# Altium project S7CAS-PLEIADES-CARTE-MERE_P02.PrjPCB (part 2 of 3)

## Sheet S7CAS-PLEIADES-CARTE-MERE_P02_FPGA_B2B3.SchDoc
size Tabloid; DocumentNumber: 6; SheetNumber: 6; SheetTotal: 14; Size: 11x17; Sheet_Name: FPGA Bank2-3
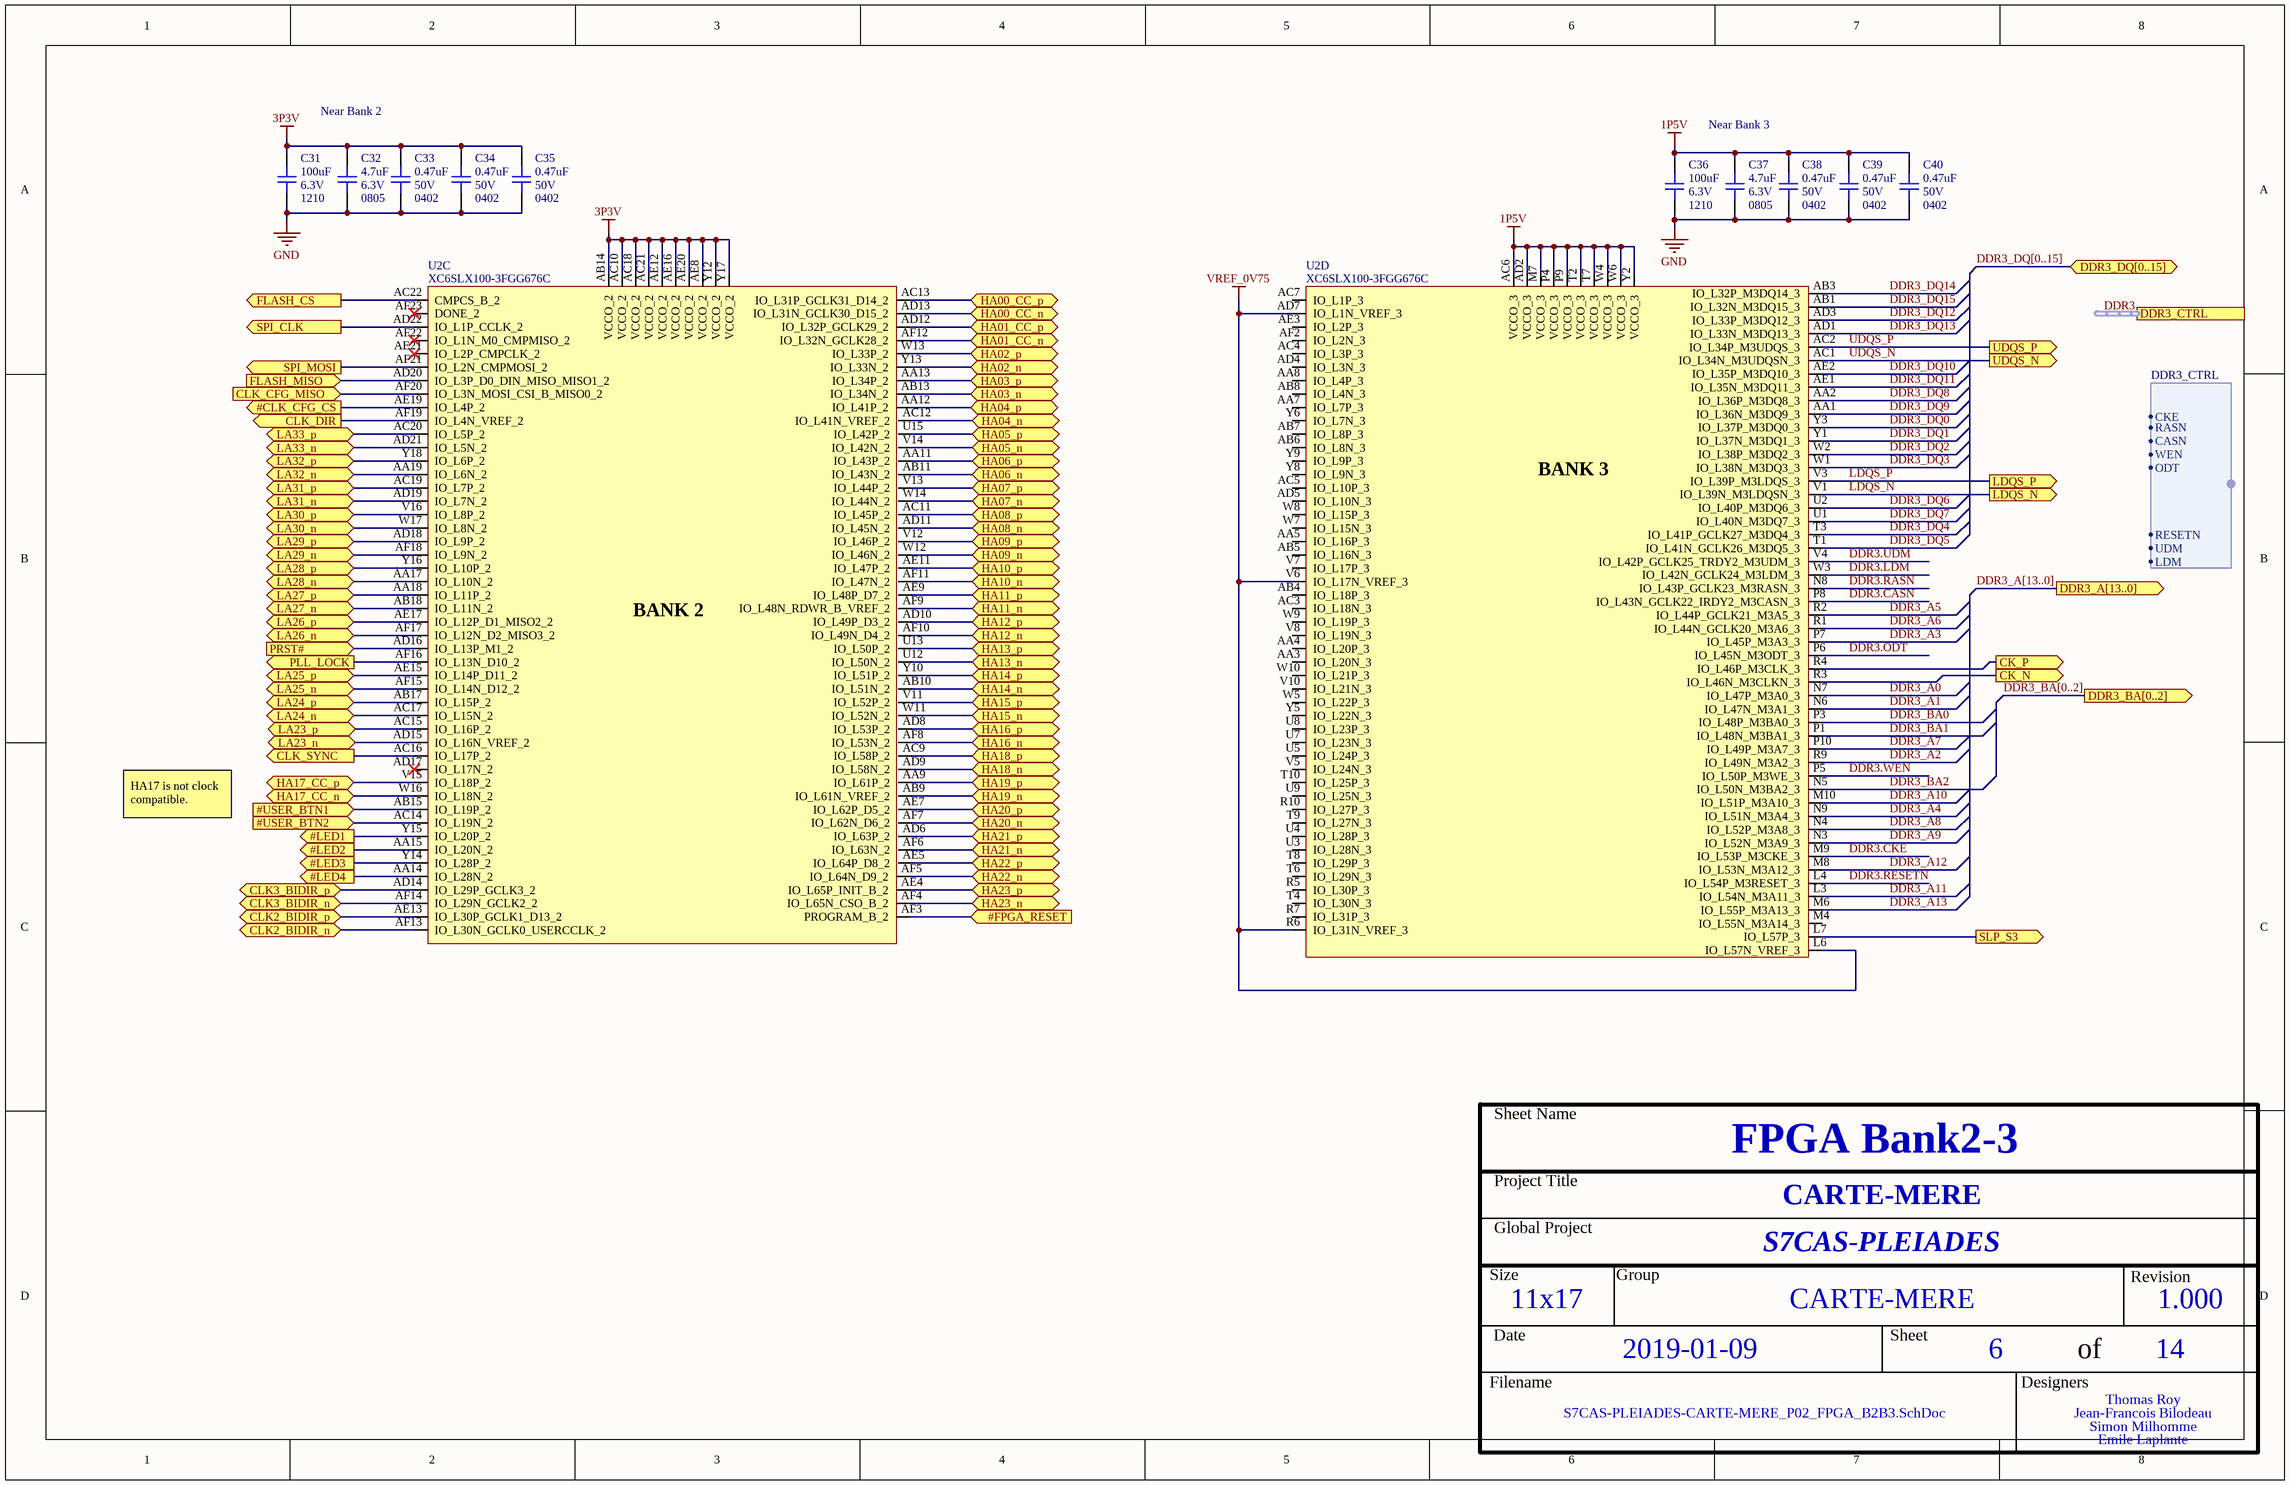
[diagram p4: S7CAS-PLEIADES-CARTE-MERE_P02_FPGA_B2B3.SchDoc]

### Parts
C31  value 100uF  Voltage: 6.3V  Package: 1210  [CAP_1210]  (hidden comment: CAP - 1210)
C32  value 4.7uF  Voltage: 6.3V  Package: 0805  [CAP_0805]  (hidden comment: CAP - 0805)
C33  value 0.47uF  Voltage: 50V  Package: 0402  [CAP_0402]  (hidden comment: CAP - 0402)
C34  value 0.47uF  Voltage: 50V  Package: 0402  [CAP_0402]  (hidden comment: CAP - 0402)
C35  value 0.47uF  Voltage: 50V  Package: 0402  [CAP_0402]  (hidden comment: CAP - 0402)
C36  value 100uF  Voltage: 6.3V  Package: 1210  [CAP_1210]  (hidden comment: CAP - 1210)
C37  value 4.7uF  Voltage: 6.3V  Package: 0805  [CAP_0805]  (hidden comment: CAP - 0805)
C38  value 0.47uF  Voltage: 50V  Package: 0402  [CAP_0402]  (hidden comment: CAP - 0402)
C39  value 0.47uF  Voltage: 50V  Package: 0402  [CAP_0402]  (hidden comment: CAP - 0402)
C40  value 0.47uF  Voltage: 50V  Package: 0402  [CAP_0402]  (hidden comment: CAP - 0402)
U2  XC6SLX100-3FGG676C  [FPGA_XILINX_FGG676]  (parts C,D of 10)

### Ports
#CLK_CFG_CS (out), #FPGA_RESET (in), #LED1 (out), #LED2 (out), #LED3 (out), #LED4 (out), #USER_BTN1 (in), #USER_BTN2 (in), CK_N (out), CK_P (out), CLK2_BIDIR_n (bidir), CLK2_BIDIR_p (bidir), CLK3_BIDIR_n (bidir), CLK3_BIDIR_p (bidir), CLK_CFG_MISO (in), CLK_DIR (out), CLK_SYNC (out), DDR3_A[13..0] (out), DDR3_BA[0..2] (out), DDR3_CTRL (harness DDR_CTRL), DDR3_DQ[0..15] (bidir), FLASH_CS (out), FLASH_MISO (in), HA00_CC_n (bidir), HA00_CC_p (bidir), HA01_CC_n (bidir), HA01_CC_p (bidir), HA02_n (bidir), HA02_p (bidir), HA03_n (bidir), HA03_p (bidir), HA04_n (bidir), HA04_p (bidir), HA05_n (bidir), HA05_p (bidir), HA06_n (bidir), HA06_p (bidir), HA07_n (bidir), HA07_p (bidir), HA08_n (bidir), HA08_p (bidir), HA09_n (bidir), HA09_p (bidir), HA10_n (bidir), HA10_p (bidir), HA11_n (bidir), HA11_p (bidir), HA12_n (bidir), HA12_p (bidir), HA13_n (bidir), HA13_p (bidir), HA14_n (bidir), HA14_p (bidir), HA15_n (bidir), HA15_p (bidir), HA16_n (bidir), HA16_p (bidir), HA17_CC_n (bidir), HA17_CC_p (bidir), HA18_n (bidir), HA18_p (bidir), HA19_n (bidir), HA19_p (bidir), HA20_n (bidir), HA20_p (bidir), HA21_n (bidir), HA21_p (bidir), HA22_n (bidir), HA22_p (bidir), HA23_n (bidir), HA23_p (bidir), LA23_n (bidir), LA23_p (bidir), LA24_n (bidir), LA24_p (bidir), LA25_n (bidir), LA25_p (bidir), LA26_n (bidir), LA26_p (bidir), LA27_n (bidir), LA27_p (bidir), LA28_n (bidir), LA28_p (bidir), LA29_n (bidir), LA29_p (bidir), LA30_n (bidir), LA30_p (bidir), LA31_n (bidir), LA31_p (bidir), LA32_n (bidir), LA32_p (bidir), LA33_n (bidir), LA33_p (bidir), LDQS_N (out), LDQS_P (out), PLL_LOCK (out), PRST# (in), SLP_S3 (out), SPI_CLK (out), SPI_MOSI (out), UDQS_N (out), UDQS_P (out)

### Harnesses
DDR3_CTRL: CKE, RASN, CASN, WEN, ODT, RESETN, UDM, LDM

### Nets
1P5V: C36.2 C37.2 C38.2 C39.2 C40.2 U2.AC6(VCCO_3) U2.AD2(VCCO_3) U2.M7(VCCO_3) U2.P4(VCCO_3) U2.P9(VCCO_3) U2.T2(VCCO_3) U2.T7(VCCO_3) U2.W4(VCCO_3) U2.W6(VCCO_3) U2.Y2(VCCO_3)
3P3V: C31.2 C32.2 C33.2 C34.2 C35.2 U2.AB14(VCCO_2) U2.AC10(VCCO_2) U2.AC18(VCCO_2) U2.AC21(VCCO_2) U2.AE8(VCCO_2) U2.AE12(VCCO_2) U2.AE16(VCCO_2) U2.AE20(VCCO_2) U2.Y12(VCCO_2) U2.Y17(VCCO_2)
GND: C31.1 C32.1 C33.1 C34.1 C35.1 C36.1 C37.1 C38.1 C39.1 C40.1
VREF_0V75: U2.AD7(IO_L1N_VREF_3) U2.L6(IO_L57N_VREF_3) U2.R6(IO_L31N_VREF_3) U2.V6(IO_L17N_VREF_3)
#CLK_CFG_CS: U2.AE19(IO_L4P_2) ; port #CLK_CFG_CS
#FPGA_RESET: U2.AF3(PROGRAM_B_2) ; port #FPGA_RESET
#LED1: U2.Y15(IO_L20P_2) ; port #LED1
#LED2: U2.AA15(IO_L20N_2) ; port #LED2
#LED3: U2.Y14(IO_L28P_2) ; port #LED3
#LED4: U2.AA14(IO_L28N_2) ; port #LED4
#USER_BTN1: U2.AB15(IO_L19P_2) ; port #USER_BTN1
#USER_BTN2: U2.AC14(IO_L19N_2) ; port #USER_BTN2
CK_N: U2.R3(IO_L46N_M3CLKN_3) ; port CK_N
CK_P: U2.R4(IO_L46P_M3CLK_3) ; port CK_P
CLK2_BIDIR_n: U2.AF13(IO_L30N_GCLK0_USERCCLK_2) ; port CLK2_BIDIR_n
CLK2_BIDIR_p: U2.AE13(IO_L30P_GCLK1_D13_2) ; port CLK2_BIDIR_p
CLK3_BIDIR_n: U2.AF14(IO_L29N_GCLK2_2) ; port CLK3_BIDIR_n
CLK3_BIDIR_p: U2.AD14(IO_L29P_GCLK3_2) ; port CLK3_BIDIR_p
CLK_CFG_MISO: U2.AF20(IO_L3N_MOSI_CSI_B_MISO0_2) ; port CLK_CFG_MISO
CLK_DIR: U2.AF19(IO_L4N_VREF_2) ; port CLK_DIR
CLK_SYNC: U2.AC16(IO_L17P_2) ; port CLK_SYNC
DDR3.CASN: U2.P8(IO_L43N_GCLK22_IRDY2_M3CASN_3)
DDR3.CKE: U2.M9(IO_L53P_M3CKE_3)
DDR3.LDM: U2.W3(IO_L42N_GCLK24_M3LDM_3)
DDR3.ODT: U2.P6(IO_L45N_M3ODT_3)
DDR3.RASN: U2.N8(IO_L43P_GCLK23_M3RASN_3)
DDR3.RESETN: U2.L4(IO_L54P_M3RESET_3)
DDR3.UDM: U2.V4(IO_L42P_GCLK25_TRDY2_M3UDM_3)
DDR3.WEN: U2.P5(IO_L50P_M3WE_3)
DDR3_A0: U2.N7(IO_L47P_M3A0_3)
DDR3_A1: U2.N6(IO_L47N_M3A1_3)
DDR3_A2: U2.R9(IO_L49N_M3A2_3)
DDR3_A3: U2.P7(IO_L45P_M3A3_3)
DDR3_A4: U2.N9(IO_L51N_M3A4_3)
DDR3_A5: U2.R2(IO_L44P_GCLK21_M3A5_3)
DDR3_A6: U2.R1(IO_L44N_GCLK20_M3A6_3)
DDR3_A7: U2.P10(IO_L49P_M3A7_3)
DDR3_A8: U2.N4(IO_L52P_M3A8_3)
DDR3_A9: U2.N3(IO_L52N_M3A9_3)
DDR3_A10: U2.M10(IO_L51P_M3A10_3)
DDR3_A11: U2.L3(IO_L54N_M3A11_3)
DDR3_A12: U2.M8(IO_L53N_M3A12_3)
DDR3_A13: U2.M6(IO_L55P_M3A13_3)
DDR3_BA0: U2.P3(IO_L48P_M3BA0_3)
DDR3_BA1: U2.P1(IO_L48N_M3BA1_3)
DDR3_BA2: U2.N5(IO_L50N_M3BA2_3)
DDR3_DQ0: U2.Y3(IO_L37P_M3DQ0_3)
DDR3_DQ1: U2.Y1(IO_L37N_M3DQ1_3)
DDR3_DQ2: U2.W2(IO_L38P_M3DQ2_3)
DDR3_DQ3: U2.W1(IO_L38N_M3DQ3_3)
DDR3_DQ4: U2.T3(IO_L41P_GCLK27_M3DQ4_3)
DDR3_DQ5: U2.T1(IO_L41N_GCLK26_M3DQ5_3)
DDR3_DQ6: U2.U2(IO_L40P_M3DQ6_3)
DDR3_DQ7: U2.U1(IO_L40N_M3DQ7_3)
DDR3_DQ8: U2.AA2(IO_L36P_M3DQ8_3)
DDR3_DQ9: U2.AA1(IO_L36N_M3DQ9_3)
DDR3_DQ10: U2.AE2(IO_L35P_M3DQ10_3)
DDR3_DQ11: U2.AE1(IO_L35N_M3DQ11_3)
DDR3_DQ12: U2.AD3(IO_L33P_M3DQ12_3)
DDR3_DQ13: U2.AD1(IO_L33N_M3DQ13_3)
DDR3_DQ14: U2.AB3(IO_L32P_M3DQ14_3)
DDR3_DQ15: U2.AB1(IO_L32N_M3DQ15_3)
FLASH_CS: U2.AC22(CMPCS_B_2) ; port FLASH_CS
FLASH_MISO: U2.AD20(IO_L3P_D0_DIN_MISO_MISO1_2) ; port FLASH_MISO
HA00_CC_n: U2.AD13(IO_L31N_GCLK30_D15_2) ; port HA00_CC_n
HA00_CC_p: U2.AC13(IO_L31P_GCLK31_D14_2) ; port HA00_CC_p
HA01_CC_n: U2.AF12(IO_L32N_GCLK28_2) ; port HA01_CC_n
HA01_CC_p: U2.AD12(IO_L32P_GCLK29_2) ; port HA01_CC_p
HA02_n: U2.Y13(IO_L33N_2) ; port HA02_n
HA02_p: U2.W13(IO_L33P_2) ; port HA02_p
HA03_n: U2.AB13(IO_L34N_2) ; port HA03_n
HA03_p: U2.AA13(IO_L34P_2) ; port HA03_p
HA04_n: U2.AC12(IO_L41N_VREF_2) ; port HA04_n
HA04_p: U2.AA12(IO_L41P_2) ; port HA04_p
HA05_n: U2.V14(IO_L42N_2) ; port HA05_n
HA05_p: U2.U15(IO_L42P_2) ; port HA05_p
HA06_n: U2.AB11(IO_L43N_2) ; port HA06_n
HA06_p: U2.AA11(IO_L43P_2) ; port HA06_p
HA07_n: U2.W14(IO_L44N_2) ; port HA07_n
HA07_p: U2.V13(IO_L44P_2) ; port HA07_p
HA08_n: U2.AD11(IO_L45N_2) ; port HA08_n
HA08_p: U2.AC11(IO_L45P_2) ; port HA08_p
HA09_n: U2.W12(IO_L46N_2) ; port HA09_n
HA09_p: U2.V12(IO_L46P_2) ; port HA09_p
HA10_n: U2.AF11(IO_L47N_2) ; port HA10_n
HA10_p: U2.AE11(IO_L47P_2) ; port HA10_p
HA11_n: U2.AF9(IO_L48N_RDWR_B_VREF_2) ; port HA11_n
HA11_p: U2.AE9(IO_L48P_D7_2) ; port HA11_p
HA12_n: U2.AF10(IO_L49N_D4_2) ; port HA12_n
HA12_p: U2.AD10(IO_L49P_D3_2) ; port HA12_p
HA13_n: U2.U12(IO_L50N_2) ; port HA13_n
HA13_p: U2.U13(IO_L50P_2) ; port HA13_p
HA14_n: U2.AB10(IO_L51N_2) ; port HA14_n
HA14_p: U2.Y10(IO_L51P_2) ; port HA14_p
HA15_n: U2.W11(IO_L52N_2) ; port HA15_n
HA15_p: U2.V11(IO_L52P_2) ; port HA15_p
HA16_n: U2.AF8(IO_L53N_2) ; port HA16_n
HA16_p: U2.AD8(IO_L53P_2) ; port HA16_p
HA17_CC_n: U2.W16(IO_L18N_2) ; port HA17_CC_n
HA17_CC_p: U2.V15(IO_L18P_2) ; port HA17_CC_p
HA18_n: U2.AD9(IO_L58N_2) ; port HA18_n
HA18_p: U2.AC9(IO_L58P_2) ; port HA18_p
HA19_n: U2.AB9(IO_L61N_VREF_2) ; port HA19_n
HA19_p: U2.AA9(IO_L61P_2) ; port HA19_p
HA20_n: U2.AF7(IO_L62N_D6_2) ; port HA20_n
HA20_p: U2.AE7(IO_L62P_D5_2) ; port HA20_p
HA21_n: U2.AF6(IO_L63N_2) ; port HA21_n
HA21_p: U2.AD6(IO_L63P_2) ; port HA21_p
HA22_n: U2.AF5(IO_L64N_D9_2) ; port HA22_n
HA22_p: U2.AE5(IO_L64P_D8_2) ; port HA22_p
HA23_n: U2.AF4(IO_L65N_CSO_B_2) ; port HA23_n
HA23_p: U2.AE4(IO_L65P_INIT_B_2) ; port HA23_p
LA23_n: U2.AD15(IO_L16N_VREF_2) ; port LA23_n
LA23_p: U2.AC15(IO_L16P_2) ; port LA23_p
LA24_n: U2.AC17(IO_L15N_2) ; port LA24_n
LA24_p: U2.AB17(IO_L15P_2) ; port LA24_p
LA25_n: U2.AF15(IO_L14N_D12_2) ; port LA25_n
LA25_p: U2.AE15(IO_L14P_D11_2) ; port LA25_p
LA26_n: U2.AF17(IO_L12N_D2_MISO3_2) ; port LA26_n
LA26_p: U2.AE17(IO_L12P_D1_MISO2_2) ; port LA26_p
LA27_n: U2.AB18(IO_L11N_2) ; port LA27_n
LA27_p: U2.AA18(IO_L11P_2) ; port LA27_p
LA28_n: U2.AA17(IO_L10N_2) ; port LA28_n
LA28_p: U2.Y16(IO_L10P_2) ; port LA28_p
LA29_n: U2.AF18(IO_L9N_2) ; port LA29_n
LA29_p: U2.AD18(IO_L9P_2) ; port LA29_p
LA30_n: U2.W17(IO_L8N_2) ; port LA30_n
LA30_p: U2.V16(IO_L8P_2) ; port LA30_p
LA31_n: U2.AD19(IO_L7N_2) ; port LA31_n
LA31_p: U2.AC19(IO_L7P_2) ; port LA31_p
LA32_n: U2.AA19(IO_L6N_2) ; port LA32_n
LA32_p: U2.Y18(IO_L6P_2) ; port LA32_p
LA33_n: U2.AD21(IO_L5N_2) ; port LA33_n
LA33_p: U2.AC20(IO_L5P_2) ; port LA33_p
LDQS_N: U2.V1(IO_L39N_M3LDQSN_3) ; port LDQS_N
LDQS_P: U2.V3(IO_L39P_M3LDQS_3) ; port LDQS_P
PLL_LOCK: U2.AF16(IO_L13N_D10_2) ; port PLL_LOCK
PRST#: U2.AD16(IO_L13P_M1_2) ; port PRST#
SLP_S3: U2.L7(IO_L57P_3) ; port SLP_S3
SPI_CLK: U2.AD22(IO_L1P_CCLK_2) ; port SPI_CLK
SPI_MOSI: U2.AF21(IO_L2N_CMPMOSI_2) ; port SPI_MOSI
UDQS_N: U2.AC1(IO_L34N_M3UDQSN_3) ; port UDQS_N
UDQS_P: U2.AC2(IO_L34P_M3UDQS_3) ; port UDQS_P

Not connected (* = marked no-connect by the designer): U2 AA3(IO_L20N_3) AA4(IO_L20P_3) AA5(IO_L16P_3) AA7(IO_L7P_3) AA8(IO_L4P_3) AB4(IO_L18P_3) AB5(IO_L16N_3) AB6(IO_L8N_3) AB7(IO_L8P_3) AB8(IO_L4N_3) AC3(IO_L18N_3) AC4(IO_L3P_3) AC5(IO_L10P_3) AC7(IO_L1P_3) AD4(IO_L3N_3) AD5(IO_L10N_3) AD17(IO_L17N_2)* AE3(IO_L2P_3) AE21(IO_L2P_CMPCLK_2)* AF2(IO_L2N_3) AF22(IO_L1N_M0_CMPMISO_2)* AF23(DONE_2)* M4(IO_L55N_M3A14_3) R5(IO_L30P_3) R7(IO_L31P_3) R10(IO_L27P_3) T4(IO_L30N_3) T6(IO_L29N_3) T8(IO_L29P_3) T9(IO_L27N_3) T10(IO_L25P_3) U3(IO_L28N_3) U4(IO_L28P_3) U5(IO_L24P_3) U7(IO_L23N_3) U8(IO_L23P_3) U9(IO_L25N_3) V5(IO_L24N_3) V7(IO_L17P_3) V8(IO_L19N_3) V10(IO_L21N_3) W5(IO_L22P_3) W7(IO_L15N_3) W8(IO_L15P_3) W9(IO_L19P_3) W10(IO_L21P_3) Y5(IO_L22N_3) Y6(IO_L7N_3) Y8(IO_L9N_3) Y9(IO_L9P_3)

### Buses and harness runs
bus DDR3_A[13..0] = port DDR3_A[13..0]
bus DDR3_BA[0..2] = port DDR3_BA[0..2]
bus DDR3_DQ[0..15] = port DDR3_DQ[0..15]
harness DDR3 = port DDR3_CTRL

### Notes on the sheet
- Near Bank 2
- Near Bank 3
- HA17 is not clock compatible.
- Sheet Name
- Project Title
- Global Project
- Size
- Group
- Revision
- Date
- Sheet
- of
- Filename
- Designers
- (in symbol FPGA_XC6SLX100-3FGG676C, part C) BANK 2
- (in symbol FPGA_XC6SLX100-3FGG676C, part D) BANK 3

### Library data of the parts
C31 C36 = CAP - 1210: Precision: 10%; Current: *; CreatedBy: Jonathan Bouchard; Power: *
C32 C37 = CAP - 0805: Precision: 10%; Current: *; CreatedBy: Jonathan Bouchard; Power: *
C33-C35 C38-C40 = CAP - 0402: Precision: 10%; Current: *; CreatedBy: Jonathan Bouchard; Power: *
U2 = FPGA_XC6SLX100-3FGG676C: FPGA - XILINX SPARTAN 6 480 I/O - BGA-676; Voltage: 1.14 V ~ 1.26 V; Current: *; Power: *; Mfg: Xilinx; Mfg Part Number: XC6SLX100-3FGG676C; HelpURL: https://www.xilinx.com/support/documentation/data_sheets/ds162.pdf; CreatedBy: Jonathan Bouchard; Temperature: 0°C ~ 85°C (TJ); Value: *; Precision: *; Package: BGA-676; Supplier 1: Digikey; Supplier Part Number 1: 122-1760-ND

## Sheet S7CAS-PLEIADES-CARTE-MERE_P02_FPGA_B4B5.SchDoc
size Tabloid; DocumentNumber: 7; SheetNumber: 7; SheetTotal: 14; Size: 11x17; Sheet_Name: FPGA Bank4-5
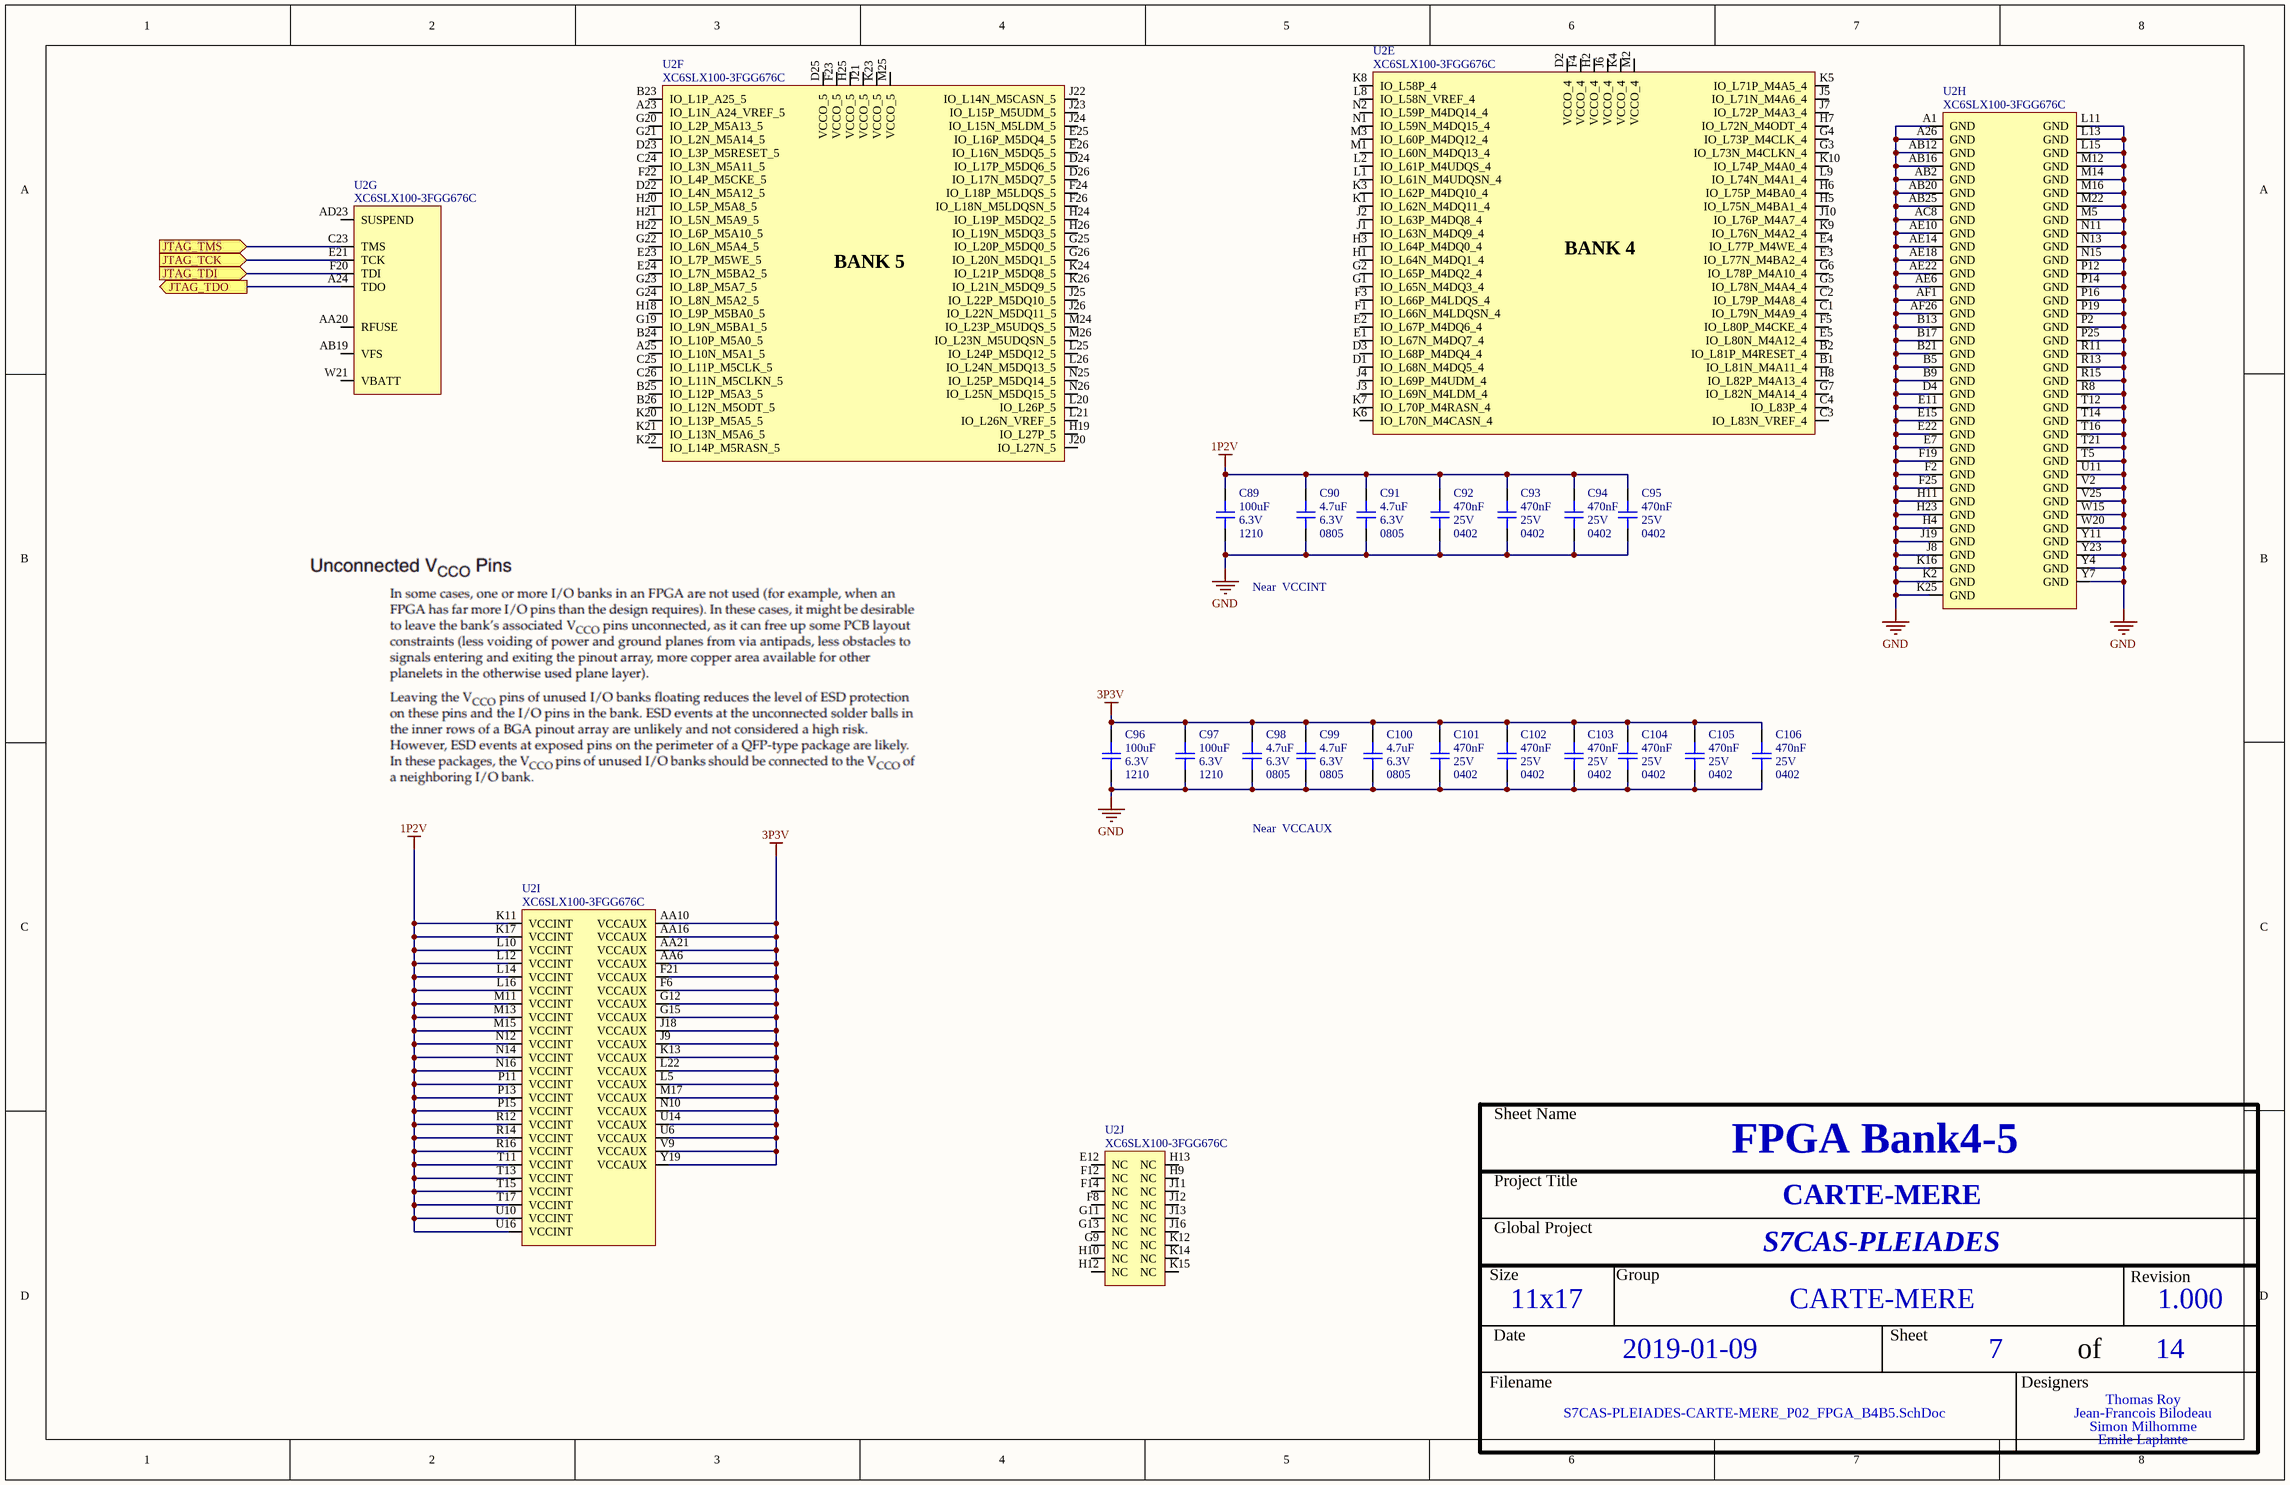
[diagram p5: S7CAS-PLEIADES-CARTE-MERE_P02_FPGA_B4B5.SchDoc]

### Parts
C89  value 100uF  Voltage: 6.3V  Package: 1210  [CAP_1210]  (hidden comment: CAP - 1210)
C90  value 4.7uF  Voltage: 6.3V  Package: 0805  [CAP_0805]  (hidden comment: CAP - 0805)
C91  value 4.7uF  Voltage: 6.3V  Package: 0805  [CAP_0805]  (hidden comment: CAP - 0805)
C92  value 470nF  Voltage: 25V  Package: 0402  [CAP_0402]  (hidden comment: CAP - 0402)
C93  value 470nF  Voltage: 25V  Package: 0402  [CAP_0402]  (hidden comment: CAP - 0402)
C94  value 470nF  Voltage: 25V  Package: 0402  [CAP_0402]  (hidden comment: CAP - 0402)
C95  value 470nF  Voltage: 25V  Package: 0402  [CAP_0402]  (hidden comment: CAP - 0402)
C96  value 100uF  Voltage: 6.3V  Package: 1210  [CAP_1210]  (hidden comment: CAP - 1210)
C97  value 100uF  Voltage: 6.3V  Package: 1210  [CAP_1210]  (hidden comment: CAP - 1210)
C98  value 4.7uF  Voltage: 6.3V  Package: 0805  [CAP_0805]  (hidden comment: CAP - 0805)
C99  value 4.7uF  Voltage: 6.3V  Package: 0805  [CAP_0805]  (hidden comment: CAP - 0805)
C100  value 4.7uF  Voltage: 6.3V  Package: 0805  [CAP_0805]  (hidden comment: CAP - 0805)
C101  value 470nF  Voltage: 25V  Package: 0402  [CAP_0402]  (hidden comment: CAP - 0402)
C102  value 470nF  Voltage: 25V  Package: 0402  [CAP_0402]  (hidden comment: CAP - 0402)
C103  value 470nF  Voltage: 25V  Package: 0402  [CAP_0402]  (hidden comment: CAP - 0402)
C104  value 470nF  Voltage: 25V  Package: 0402  [CAP_0402]  (hidden comment: CAP - 0402)
C105  value 470nF  Voltage: 25V  Package: 0402  [CAP_0402]  (hidden comment: CAP - 0402)
C106  value 470nF  Voltage: 25V  Package: 0402  [CAP_0402]  (hidden comment: CAP - 0402)
U2  XC6SLX100-3FGG676C  [FPGA_XILINX_FGG676]  (parts E,F,G,H,I,J of 10)

### Ports
JTAG_TCK (in), JTAG_TDI (in), JTAG_TDO (out), JTAG_TMS (in)

### Nets
1P2V: C89.2 C90.2 C91.2 C92.2 C93.2 C94.2 C95.2 U2.K11(VCCINT) U2.K17(VCCINT) U2.L10(VCCINT) U2.L12(VCCINT) U2.L14(VCCINT) U2.L16(VCCINT) U2.M11(VCCINT) U2.M13(VCCINT) U2.M15(VCCINT) U2.N12(VCCINT) U2.N14(VCCINT) U2.N16(VCCINT) U2.P11(VCCINT) U2.P13(VCCINT) U2.P15(VCCINT) U2.R12(VCCINT) U2.R14(VCCINT) U2.R16(VCCINT) U2.T11(VCCINT) U2.T13(VCCINT) U2.T15(VCCINT) U2.T17(VCCINT) U2.U10(VCCINT) U2.U16(VCCINT)
3P3V: C96.2 C97.2 C98.2 C99.2 C100.2 C101.2 C102.2 C103.2 C104.2 C105.2 C106.2 U2.AA6(VCCAUX) U2.AA10(VCCAUX) U2.AA16(VCCAUX) U2.AA21(VCCAUX) U2.F6(VCCAUX) U2.F21(VCCAUX) U2.G12(VCCAUX) U2.G15(VCCAUX) U2.J9(VCCAUX) U2.J18(VCCAUX) U2.K13(VCCAUX) U2.L5(VCCAUX) U2.L22(VCCAUX) U2.M17(VCCAUX) U2.N10(VCCAUX) U2.U6(VCCAUX) U2.U14(VCCAUX) U2.V9(VCCAUX) U2.Y19(VCCAUX)
GND: C89.1 C90.1 C91.1 C92.1 C93.1 C94.1 C95.1 C96.1 C97.1 C98.1 C99.1 C100.1 C101.1 C102.1 C103.1 C104.1 C105.1 C106.1 U2.A1(GND) U2.A26(GND) U2.AB2(GND) U2.AB12(GND) U2.AB16(GND) U2.AB20(GND) U2.AB25(GND) U2.AC8(GND) U2.AE6(GND) U2.AE10(GND) U2.AE14(GND) U2.AE18(GND) U2.AE22(GND) U2.AF1(GND) U2.AF26(GND) U2.B5(GND) U2.B9(GND) U2.B13(GND) U2.B17(GND) U2.B21(GND) U2.D4(GND) U2.E7(GND) U2.E11(GND) U2.E15(GND) U2.E22(GND) U2.F2(GND) U2.F19(GND) U2.F25(GND) U2.H4(GND) U2.H11(GND) U2.H23(GND) U2.J8(GND) U2.J19(GND) U2.K2(GND) U2.K16(GND) U2.K25(GND) U2.L11(GND) U2.L13(GND) U2.L15(GND) U2.M5(GND) U2.M12(GND) U2.M14(GND) U2.M16(GND) U2.M22(GND) U2.N11(GND) U2.N13(GND) U2.N15(GND) U2.P2(GND) U2.P12(GND) U2.P14(GND) U2.P16(GND) U2.P19(GND) U2.P25(GND) U2.R8(GND) U2.R11(GND) U2.R13(GND) U2.R15(GND) U2.T5(GND) U2.T12(GND) U2.T14(GND) U2.T16(GND) U2.T21(GND) U2.U11(GND) U2.V2(GND) U2.V25(GND) U2.W15(GND) U2.W20(GND) U2.Y4(GND) U2.Y7(GND) U2.Y11(GND) U2.Y23(GND)
JTAG_TCK: U2.E21(TCK) ; port JTAG_TCK
JTAG_TDI: U2.F20(TDI) ; port JTAG_TDI
JTAG_TDO: U2.A24(TDO) ; port JTAG_TDO
JTAG_TMS: U2.C23(TMS) ; port JTAG_TMS

Not connected (* = marked no-connect by the designer): U2 A23(IO_L1N_A24_VREF_5) A25(IO_L10N_M5A1_5) AA20(RFUSE) AB19(VFS) AD23(SUSPEND) B1(IO_L81N_M4A11_4) B2(IO_L81P_M4RESET_4) B23(IO_L1P_A25_5) B24(IO_L10P_M5A0_5) B25(IO_L12P_M5A3_5) B26(IO_L12N_M5ODT_5) C1(IO_L79N_M4A9_4) C2(IO_L79P_M4A8_4) C3(IO_L83N_VREF_4) C4(IO_L83P_4) C24(IO_L3N_M5A11_5) C25(IO_L11P_M5CLK_5) C26(IO_L11N_M5CLKN_5) D1(IO_L68N_M4DQ5_4) D2(VCCO_4) D3(IO_L68P_M4DQ4_4) D22(IO_L4N_M5A12_5) D23(IO_L3P_M5RESET_5) D24(IO_L17P_M5DQ6_5) D25(VCCO_5) D26(IO_L17N_M5DQ7_5) E1(IO_L67N_M4DQ7_4) E2(IO_L67P_M4DQ6_4) E3(IO_L77N_M4BA2_4) E4(IO_L77P_M4WE_4) E5(IO_L80N_M4A12_4) E12(NC) E23(IO_L7P_M5WE_5) E24(IO_L7N_M5BA2_5) E25(IO_L16P_M5DQ4_5) E26(IO_L16N_M5DQ5_5) F1(IO_L66N_M4LDQSN_4) F3(IO_L66P_M4LDQS_4) F4(VCCO_4) F5(IO_L80P_M4CKE_4) F8(NC) F12(NC) F14(NC) F22(IO_L4P_M5CKE_5) F23(VCCO_5) F24(IO_L18P_M5LDQS_5) F26(IO_L18N_M5LDQSN_5) G1(IO_L65N_M4DQ3_4) G2(IO_L65P_M4DQ2_4) G3(IO_L73N_M4CLKN_4) G4(IO_L73P_M4CLK_4) G5(IO_L78N_M4A4_4) G6(IO_L78P_M4A10_4) G7(IO_L82N_M4A14_4) G9(NC) G11(NC) G13(NC) G19(IO_L9N_M5BA1_5) G20(IO_L2P_M5A13_5) G21(IO_L2N_M5A14_5) G22(IO_L6N_M5A4_5) G23(IO_L8P_M5A7_5) G24(IO_L8N_M5A2_5) G25(IO_L20P_M5DQ0_5) G26(IO_L20N_M5DQ1_5) H1(IO_L64N_M4DQ1_4) H2(VCCO_4) H3(IO_L64P_M4DQ0_4) H5(IO_L75N_M4BA1_4) H6(IO_L75P_M4BA0_4) H7(IO_L72N_M4ODT_4) H8(IO_L82P_M4A13_4) H9(NC) H10(NC) H12(NC) H13(NC) H18(IO_L9P_M5BA0_5) H19(IO_L27P_5) H20(IO_L5P_M5A8_5) H21(IO_L5N_M5A9_5) H22(IO_L6P_M5A10_5) H24(IO_L19P_M5DQ2_5) H25(VCCO_5) H26(IO_L19N_M5DQ3_5) J1(IO_L63N_M4DQ9_4) J2(IO_L63P_M4DQ8_4) J3(IO_L69N_M4LDM_4) J4(IO_L69P_M4UDM_4) J5(IO_L71N_M4A6_4) J6(VCCO_4) J7(IO_L72P_M4A3_4) J10(IO_L76P_M4A7_4) J11(NC) J12(NC) J13(NC) J16(NC) J20(IO_L27N_5) J21(VCCO_5) J22(IO_L14N_M5CASN_5) J23(IO_L15P_M5UDM_5) J24(IO_L15N_M5LDM_5) J25(IO_L22P_M5DQ10_5) J26(IO_L22N_M5DQ11_5) K1(IO_L62N_M4DQ11_4) K3(IO_L62P_M4DQ10_4) K4(VCCO_4) K5(IO_L71P_M4A5_4) K6(IO_L70N_M4CASN_4) K7(IO_L70P_M4RASN_4) K8(IO_L58P_4) K9(IO_L76N_M4A2_4) K10(IO_L74P_M4A0_4) K12(NC) K14(NC) K15(NC) K20(IO_L13P_M5A5_5) K21(IO_L13N_M5A6_5) K22(IO_L14P_M5RASN_5) K23(VCCO_5) K24(IO_L21P_M5DQ8_5) K26(IO_L21N_M5DQ9_5) L1(IO_L61N_M4UDQSN_4) L2(IO_L61P_M4UDQS_4) L8(IO_L58N_VREF_4) L9(IO_L74N_M4A1_4) L20(IO_L26P_5) L21(IO_L26N_VREF_5) L25(IO_L24P_M5DQ12_5) L26(IO_L24N_M5DQ13_5) M1(IO_L60N_M4DQ13_4) M2(VCCO_4) M3(IO_L60P_M4DQ12_4) M24(IO_L23P_M5UDQS_5) M25(VCCO_5) M26(IO_L23N_M5UDQSN_5) N1(IO_L59N_M4DQ15_4) N2(IO_L59P_M4DQ14_4) N25(IO_L25P_M5DQ14_5) N26(IO_L25N_M5DQ15_5) W21(VBATT)

### Notes on the sheet
- Near  VCCINT
- Near  VCCAUX
- Sheet Name
- Project Title
- Global Project
- Size
- Group
- Revision
- Date
- Sheet
- of
- Filename
- Designers
- (in symbol FPGA_XC6SLX100-3FGG676C, part E) BANK 4
- (in symbol FPGA_XC6SLX100-3FGG676C, part F) BANK 5

### Library data of the parts
C89 C96 C97 = CAP - 1210: Precision: 10%; Current: *; CreatedBy: Jonathan Bouchard; Power: *
C90 C91 C98-C100 = CAP - 0805: Precision: 10%; Current: *; CreatedBy: Jonathan Bouchard; Power: *
C92-C95 C101-C106 = CAP - 0402: Precision: 10%; Current: *; CreatedBy: Jonathan Bouchard; Power: *
U2 = FPGA_XC6SLX100-3FGG676C: as U2 on sheet S7CAS-PLEIADES-CARTE-MERE_P02_FPGA_B2B3; Current: *; Power: *; Mfg: Xilinx; Mfg Part Number: XC6SLX100-3FGG676C; HelpURL: https://www.xilinx.com/support/documentation/data_sheets/ds162.pdf; CreatedBy: Jonathan Bouchard; Temperature: 0°C ~ 85°C (TJ); Value: *; Precision: *; Package: BGA-676; Supplier 1: Digikey; Supplier Part Number 1: 122-1760-ND

## Sheet S7CAS-PLEIADES-CARTE-MERE_P02_DDR3.SchDoc
size Tabloid; DocumentNumber: 8; SheetNumber: 8; SheetTotal: 14; Size: 11x17; Sheet_Name: DDR3
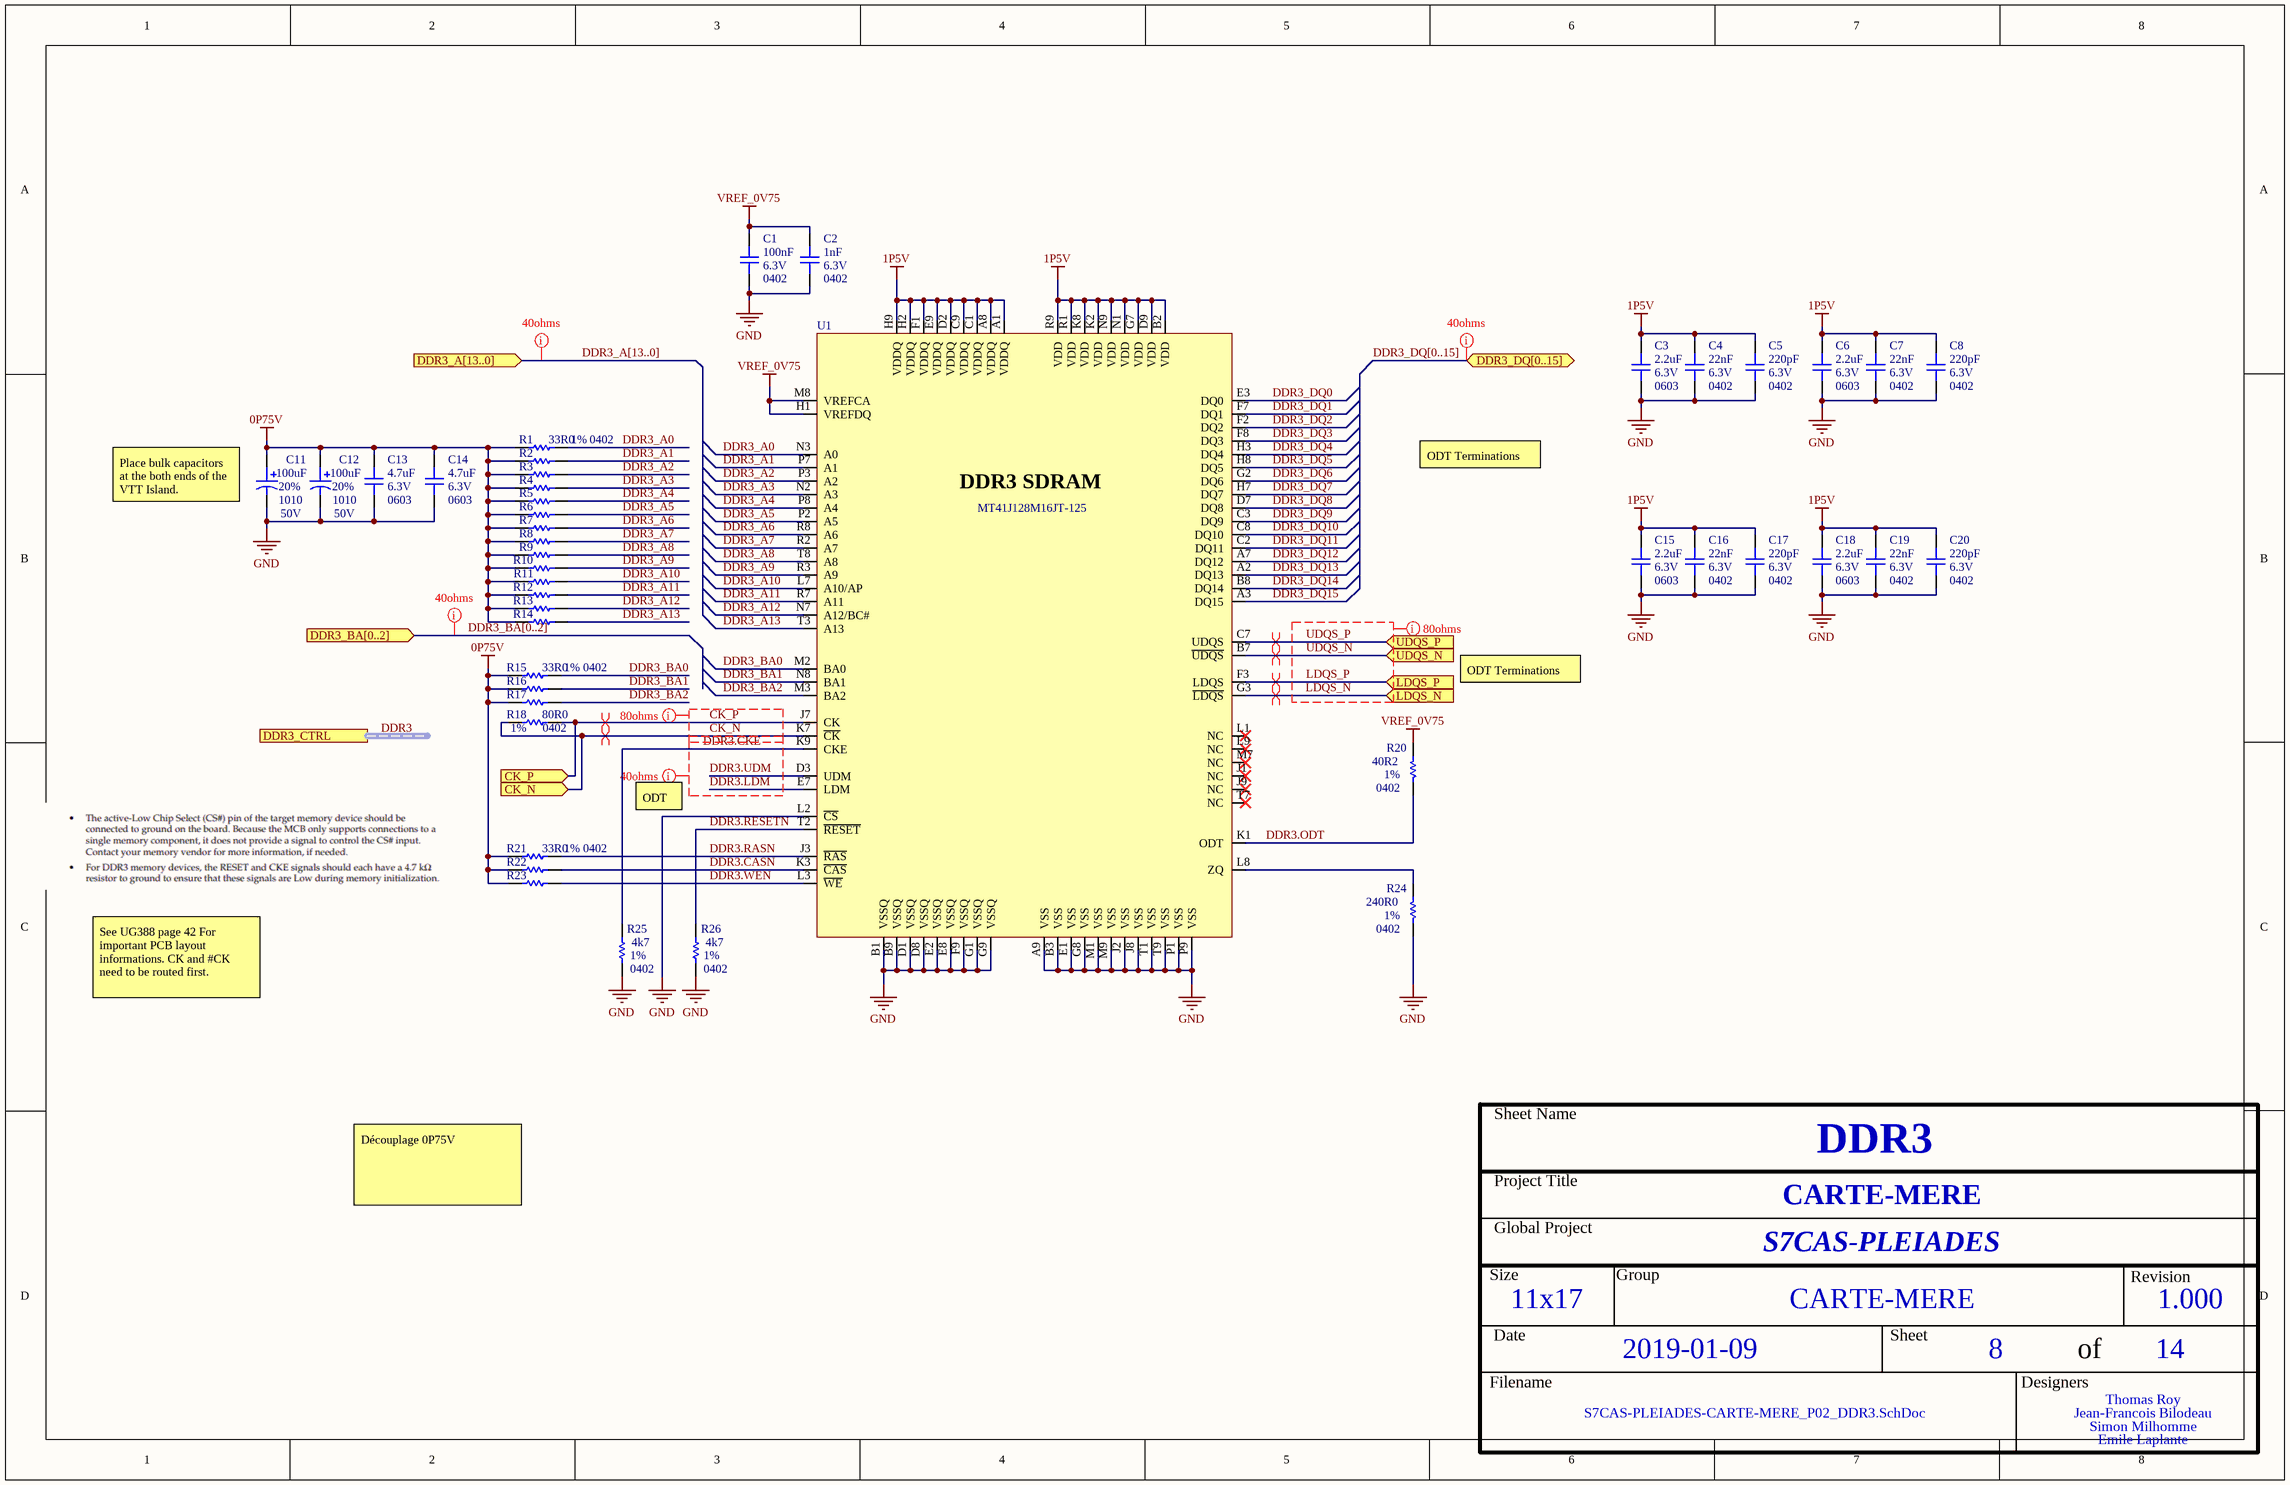
[diagram p6: S7CAS-PLEIADES-CARTE-MERE_P02_DDR3.SchDoc]

### Parts
C1  value 100nF  Voltage: 6.3V  Package: 0402  [CAP_0402]  (hidden comment: CAP - 0402)
C2  value 1nF  Voltage: 6.3V  Package: 0402  [CAP_0402]  (hidden comment: CAP - 0402)
C3  value 2.2uF  Voltage: 6.3V  Package: 0603  [CAP_0603]  (hidden comment: CAP - 0603)
C4  value 22nF  Voltage: 6.3V  Package: 0402  [CAP_0402]  (hidden comment: CAP - 0402)
C5  value 220pF  Voltage: 6.3V  Package: 0402  [CAP_0402]  (hidden comment: CAP - 0402)
C6  value 2.2uF  Voltage: 6.3V  Package: 0603  [CAP_0603]  (hidden comment: CAP - 0603)
C7  value 22nF  Voltage: 6.3V  Package: 0402  [CAP_0402]  (hidden comment: CAP - 0402)
C8  value 220pF  Voltage: 6.3V  Package: 0402  [CAP_0402]  (hidden comment: CAP - 0402)
C11  value 100uF  Voltage: 50V  Package: 1010  Precision: 20%  [CAP_ALU_1010_vishay]  (hidden comment: MAL215099101E3)
C12  value 100uF  Voltage: 50V  Package: 1010  Precision: 20%  [CAP_ALU_1010_vishay]  (hidden comment: MAL215099101E3)
C13  value 4.7uF  Voltage: 6.3V  Package: 0603  [CAP_0603]  (hidden comment: CAP - 0603)
C14  value 4.7uF  Voltage: 6.3V  Package: 0603  [CAP_0603]  (hidden comment: CAP - 0603)
C15  value 2.2uF  Voltage: 6.3V  Package: 0603  [CAP_0603]  (hidden comment: CAP - 0603)
C16  value 22nF  Voltage: 6.3V  Package: 0402  [CAP_0402]  (hidden comment: CAP - 0402)
C17  value 220pF  Voltage: 6.3V  Package: 0402  [CAP_0402]  (hidden comment: CAP - 0402)
C18  value 2.2uF  Voltage: 6.3V  Package: 0603  [CAP_0603]  (hidden comment: CAP - 0603)
C19  value 22nF  Voltage: 6.3V  Package: 0402  [CAP_0402]  (hidden comment: CAP - 0402)
C20  value 220pF  Voltage: 6.3V  Package: 0402  [CAP_0402]  (hidden comment: CAP - 0402)
R1  value 33R0  Package: 0402  Precision: 1%  [RES_0402]  (hidden comment: RES - 0402)
R2  RES - 0402  [RES_0402]  (value not drawn)
R3  RES - 0402  [RES_0402]  (value not drawn)
R4  RES - 0402  [RES_0402]  (value not drawn)
R5  RES - 0402  [RES_0402]  (value not drawn)
R6  RES - 0402  [RES_0402]  (value not drawn)
R7  RES - 0402  [RES_0402]  (value not drawn)
R8  RES - 0402  [RES_0402]  (value not drawn)
R9  RES - 0402  [RES_0402]  (value not drawn)
R10  RES - 0402  [RES_0402]  (value not drawn)
R11  RES - 0402  [RES_0402]  (value not drawn)
R12  RES - 0402  [RES_0402]  (value not drawn)
R13  RES - 0402  [RES_0402]  (value not drawn)
R14  RES - 0402  [RES_0402]  (value not drawn)
R15  value 33R0  Package: 0402  Precision: 1%  [RES_0402]  (hidden comment: RES - 0402)
R16  RES - 0402  [RES_0402]  (value not drawn)
R17  RES - 0402  [RES_0402]  (value not drawn)
R18  value 80R0  Package: 0402  Precision: 1%  [RES_0402]  (hidden comment: RES - 0402)
R20  value 40R2  Package: 0402  Precision: 1%  [RES_0402]  (hidden comment: RES - 0402)
R21  value 33R0  Package: 0402  Precision: 1%  [RES_0402]  (hidden comment: RES - 0402)
R22  RES - 0402  [RES_0402]  (value not drawn)
R23  RES - 0402  [RES_0402]  (value not drawn)
R24  value 240R0  Package: 0402  Precision: 1%  [RES_0402]  (hidden comment: RES - 0402)
R25  value 4k7  Package: 0402  Precision: 1%  [RES_0402]  (hidden comment: RES - 0402)
R26  value 4k7  Package: 0402  Precision: 1%  [RES_0402]  (hidden comment: RES - 0402)
U1  MT41J128M16JT-125  [MEM_DDR3_MT41J128M16JT-125]

### Ports
CK_N (in), CK_P (in), DDR3_A[13..0] (in), DDR3_BA[0..2] (in), DDR3_CTRL (harness DDR_CTRL), DDR3_DQ[0..15] (bidir), LDQS_N (in), LDQS_P (in), UDQS_N (in), UDQS_P (in)

### Nets
0P75V: C11.1 C12.1 C13.2 C14.2 R1.2 R2.2 R3.2 R4.2 R5.2 R6.2 R7.2 R8.2 R9.2 R10.2 R11.2 R12.2 R13.2 R14.2 R15.2 R16.2 R17.2 R21.2 R22.2 R23.2
1P5V: C3.2 C4.2 C5.2 C6.2 C7.2 C8.2 C15.2 C16.2 C17.2 C18.2 C19.2 C20.2 U1.A1(VDDQ) U1.A8(VDDQ) U1.B2(VDD) U1.C1(VDDQ) U1.C9(VDDQ) U1.D2(VDDQ) U1.D9(VDD) U1.E9(VDDQ) U1.F1(VDDQ) U1.G7(VDD) U1.H2(VDDQ) U1.H9(VDDQ) U1.K2(VDD) U1.K8(VDD) U1.N1(VDD) U1.N9(VDD) U1.R1(VDD) U1.R9(VDD)
GND: C1.1 C2.1 C3.1 C4.1 C5.1 C6.1 C7.1 C8.1 C11.2 C12.2 C13.1 C14.1 C15.1 C16.1 C17.1 C18.1 C19.1 C20.1 R24.1 R25.1 R26.1 U1.A9(VSS) U1.B1(VSSQ) U1.B3(VSS) U1.B9(VSSQ) U1.D1(VSSQ) U1.D8(VSSQ) U1.E1(VSS) U1.E2(VSSQ) U1.E8(VSSQ) U1.F9(VSSQ) U1.G1(VSSQ) U1.G8(VSS) U1.G9(VSSQ) U1.J2(VSS) U1.J8(VSS) U1.L2(~{CS}) U1.M1(VSS) U1.M9(VSS) U1.P1(VSS) U1.P9(VSS) U1.T1(VSS) U1.T9(VSS)
VREF_0V75: C1.2 C2.2 R20.2 U1.H1(VREFDQ) U1.M8(VREFCA)
CK_N: R18.2 U1.K7(~{CK}) ; port CK_N
CK_P: R18.1 U1.J7(CK) ; port CK_P
DDR3.CASN: R22.1 U1.K3(~{CAS})
DDR3.CKE: R25.2 U1.K9(CKE)
DDR3.LDM: U1.E7(LDM)
DDR3.ODT: R20.1 U1.K1(ODT)
DDR3.RASN: R21.1 U1.J3(~{RAS})
DDR3.RESETN: R26.2 U1.T2(~{RESET})
DDR3.UDM: U1.D3(UDM)
DDR3.WEN: R23.1 U1.L3(~{WE})
DDR3_A0: R1.1 U1.N3(A0)
DDR3_A1: R2.1 U1.P7(A1)
DDR3_A2: R3.1 U1.P3(A2)
DDR3_A3: R4.1 U1.N2(A3)
DDR3_A4: R5.1 U1.P8(A4)
DDR3_A5: R6.1 U1.P2(A5)
DDR3_A6: R7.1 U1.R8(A6)
DDR3_A7: R8.1 U1.R2(A7)
DDR3_A8: R9.1 U1.T8(A8)
DDR3_A9: R10.1 U1.R3(A9)
DDR3_A10: R11.1 U1.L7(A10/AP)
DDR3_A11: R12.1 U1.R7(A11)
DDR3_A12: R13.1 U1.N7(A12/BC#)
DDR3_A13: R14.1 U1.T3(A13)
DDR3_BA0: R15.1 U1.M2(BA0)
DDR3_BA1: R16.1 U1.N8(BA1)
DDR3_BA2: R17.1 U1.M3(BA2)
DDR3_DQ0: U1.E3(DQ0)
DDR3_DQ1: U1.F7(DQ1)
DDR3_DQ2: U1.F2(DQ2)
DDR3_DQ3: U1.F8(DQ3)
DDR3_DQ4: U1.H3(DQ4)
DDR3_DQ5: U1.H8(DQ5)
DDR3_DQ6: U1.G2(DQ6)
DDR3_DQ7: U1.H7(DQ7)
DDR3_DQ8: U1.D7(DQ8)
DDR3_DQ9: U1.C3(DQ9)
DDR3_DQ10: U1.C8(DQ10)
DDR3_DQ11: U1.C2(DQ11)
DDR3_DQ12: U1.A7(DQ12)
DDR3_DQ13: U1.A2(DQ13)
DDR3_DQ14: U1.B8(DQ14)
DDR3_DQ15: U1.A3(DQ15)
LDQS_N: U1.G3(~{LDQS}) ; port LDQS_N
LDQS_P: U1.F3(LDQS) ; port LDQS_P
UDQS_N: U1.B7(~{UDQS}) ; port UDQS_N
UDQS_P: U1.C7(UDQS) ; port UDQS_P
NetR24_2: R24.2 U1.L8(ZQ)

Not connected (* = marked no-connect by the designer): U1 J1(NC)* J9(NC)* L1(NC)* L9(NC)* M7(NC)* T7(NC)*

### Buses and harness runs
bus DDR3_A[13..0] = port DDR3_A[13..0]
bus DDR3_BA[0..2] = port DDR3_BA[0..2]
bus DDR3_DQ[0..15] = port DDR3_DQ[0..15]
harness DDR3 = port DDR3_CTRL

### Layout directives
differential pair: CK_N, CK_P, LDQS_N, LDQS_P, UDQS_N, UDQS_P
net class 40ohms: (no net found under the mark), CK_N, DDR3.CKE, DDR3.LDM, DDR3.UDM
net class 80ohms: CK_N, CK_P, LDQS_N, LDQS_P, UDQS_N, UDQS_P

### Notes on the sheet
- (near C11) Place bulk capacitors at the both ends of the VTT Island.
- ODT Terminations
- ODT
- See UG388 page 42 For important PCB layout informations. CK and #CK need to be routed first.
- Découplage 0P75V
- Sheet Name
- Project Title
- Global Project
- Size
- Group
- Revision
- Date
- Sheet
- of
- Filename
- Designers
- (in symbol MEM_DDR3_MT41J128M16JT-125:K TR) DDR3 SDRAM

### Library data of the parts
C1 C2 C4 C5 C7 C8 C16 C17 C19 C20 = CAP - 0402: Mfg Part Number: GRM022R60J104KE15; Mfg: Murata; Precision: 10%; Current: *; CreatedBy: Jonathan Bouchard; Power: *
C3 C6 C13-C15 C18 = CAP - 0603: Precision: 10%; Current: *; CreatedBy: Jonathan Bouchard; Power: *
C11 C12 = CAP_ALU_MAL215099101E3: CAP - ALU 100uF 20% 50V - 1010; Current: 490mA; Mfg: Vishay Dale; Mfg Part Number: MAL215099101E3; HelpURL: http://www.vishay.com/docs/28395/150crz.pdf; CreatedBy: Jonathan Bouchard; Temperature: -55°C to 125°C; Power: *; Supplier 1: Digikey; Supplier Part Number 1: 4399PHDKR-ND
R1-R18 R20-R26 = RES - 0402: Voltage: 50V; Power: 1/16W; Current: *; CreatedBy: Jonathan Bouchard
U1 = MEM_DDR3_MT41J128M16JT-125:K TR: MEM - DDR3 SDRAM 2GBIT 800MHZ - TFBGA-96; Voltage: 1.425 V ~ 1.575 V; Mfg: Micrel; Current: *; Power: *; Mfg Part Number: http://www.micron.com/~/media/Documents/Products/Data%20Sheet/DRAM/DDR3/2Gb_DDR3_SDRAM.pdf; HelpURL: http://ww1.microchip.com/downloads/en/DeviceDoc/00002275A.pdf; CreatedBy: Jonathan Bouchard; Temperature: 0°C ~ 95°C (TC); Value: *; Precision: *; Package: TFBGA-96; Supplier 1: Digikey; Supplier Part Number 1: 557-1611-1-ND

## Sheet S7CAS-PLEIADES-CARTE-MERE_P02_MOTOR_CTRL.SchDoc
size Tabloid; DocumentNumber: 9; SheetNumber: 9; SheetTotal: 14; Size: 11x17; Sheet_Name: Control du Moteur
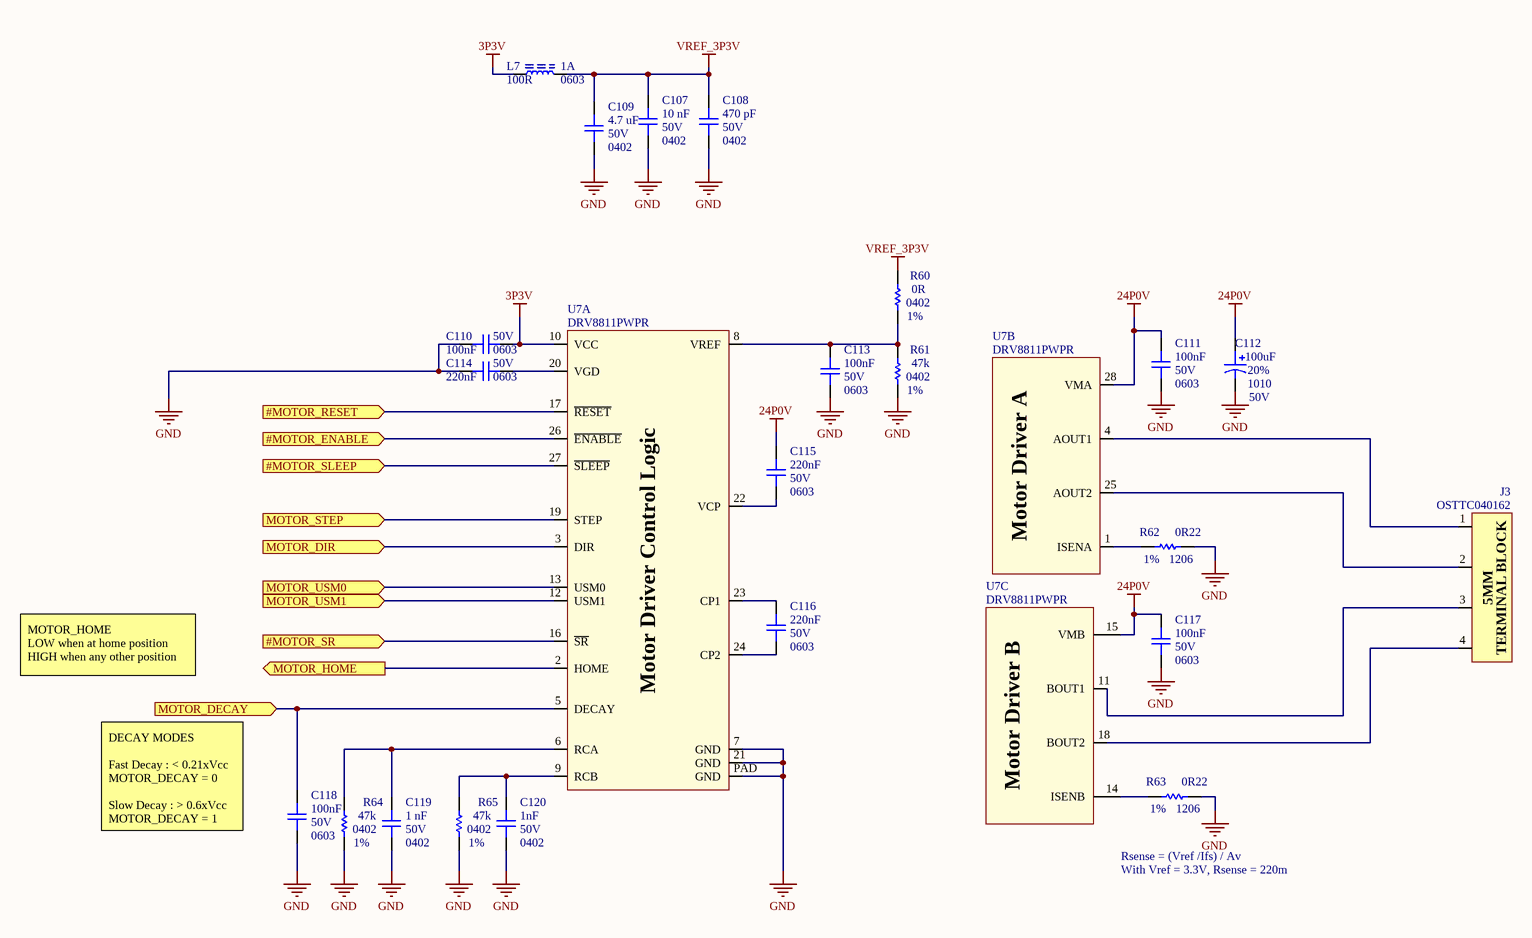
[diagram p7: S7CAS-PLEIADES-CARTE-MERE_P02_MOTOR_CTRL.SchDoc]

### Parts
C107  value 10 nF  Voltage: 50V  Package: 0402  [CAP_0402]  (hidden comment: CAP - 0402)
C108  value 470 pF  Voltage: 50V  Package: 0402  [CAP_0402]  (hidden comment: CAP - 0402)
C109  value 4.7 uF  Voltage: 50V  Package: 0402  [CAP_0402]  (hidden comment: CAP - 0402)
C110  value 100nF  Voltage: 50V  Package: 0603  [CAP_0603]  (hidden comment: CAP - 1206)
C111  value 100nF  Voltage: 50V  Package: 0603  [CAP_0603]  (hidden comment: CAP - 1206)
C112  value 100uF  Voltage: 50V  Package: 1010  Precision: 20%  [CAP_ALU_1010_vishay]  (hidden comment: MAL215099101E3)
C113  value 100nF  Voltage: 50V  Package: 0603  [CAP_0603]  (hidden comment: CAP - 1206)
C114  value 220nF  Voltage: 50V  Package: 0603  [CAP_0603]  (hidden comment: CAP - 1206)
C115  value 220nF  Voltage: 50V  Package: 0603  [CAP_0603]  (hidden comment: CAP - 1206)
C116  value 220nF  Voltage: 50V  Package: 0603  [CAP_0603]  (hidden comment: CAP - 1206)
C117  value 100nF  Voltage: 50V  Package: 0603  [CAP_0603]  (hidden comment: CAP - 1206)
C118  value 100nF  Voltage: 50V  Package: 0603  [CAP_0603]  (hidden comment: CAP - 1206)
C119  value 1 nF  Voltage: 50V  Package: 0402  [CAP_0402]  (hidden comment: CAP - 1206)
C120  value 1nF  Voltage: 50V  Package: 0402  [CAP_0402]  (hidden comment: CAP - 1206)
J3  OSTTC040162  [CONN_TERMINAL_OSTTA040161]
L7  value 100R  Current: 1A  Package: 0603  [FER_0603]  (hidden comment: FER - 0603)
R60  value 0R  Package: 0402  Precision: 1%  [RES_0402]  (hidden comment: RES - 0402)
R61  value 47k  Package: 0402  Precision: 1%  [RES_0402]  (hidden comment: RES - 0402)
R62  value 0R22  Package: 1206  Precision: 1%  [RES_0402]  (hidden comment: RES - 0402)
R63  value 0R22  Package: 1206  Precision: 1%  [RES_0402]  (hidden comment: RES - 0402)
R64  value 47k  Package: 0402  Precision: 1%  [RES_0402]  (hidden comment: RES - 0402)
R65  value 47k  Package: 0402  Precision: 1%  [RES_0402]  (hidden comment: RES - 0402)
U7  DRV8811PWPR  [POW_MOTOR_DRV8811PWPR]  (parts A,B,C of 3)

### Ports
#MOTOR_ENABLE (in), #MOTOR_RESET (in), #MOTOR_SLEEP (in), #MOTOR_SR (in), MOTOR_DECAY (in), MOTOR_DIR (in), MOTOR_HOME (out), MOTOR_STEP (in), MOTOR_USM0 (in), MOTOR_USM1 (in)

### Nets
3P3V: C110.1 L7.2 U7.10(VCC)
24P0V: C111.2 C112.1 C115.2 C117.2 U7.15(VMB) U7.28(VMA)
GND: C107.1 C108.1 C109.1 C110.2 C111.1 C112.2 C113.1 C114.2 C117.1 C118.1 C119.1 C120.1 R61.2 R62.1 R63.1 R64.2 R65.2 U7.7(GND) U7.21(GND) U7.PAD(GND)
VREF_3P3V: C107.2 C108.2 C109.2 L7.1 R60.1
#MOTOR_ENABLE: U7.26(~{ENABLE}) ; port #MOTOR_ENABLE
#MOTOR_RESET: U7.17(~{RESET}) ; port #MOTOR_RESET
#MOTOR_SLEEP: U7.27(~{SLEEP}) ; port #MOTOR_SLEEP
#MOTOR_SR: U7.16(~{SR}) ; port #MOTOR_SR
MOTOR_DECAY: C118.2 U7.5(DECAY) ; port MOTOR_DECAY
MOTOR_DIR: U7.3(DIR) ; port MOTOR_DIR
MOTOR_HOME: U7.2(HOME) ; port MOTOR_HOME
MOTOR_STEP: U7.19(STEP) ; port MOTOR_STEP
MOTOR_USM0: U7.13(USM0) ; port MOTOR_USM0
MOTOR_USM1: U7.12(USM1) ; port MOTOR_USM1
NetC113_2: C113.2 R60.2 R61.1 U7.8(VREF)
NetC114_1: C114.1 U7.20(VGD)
NetC115_1: C115.1 U7.22(VCP)
NetC116_1: C116.1 U7.24(CP2)
NetC116_2: C116.2 U7.23(CP1)
NetC119_2: C119.2 R64.1 U7.6(RCA)
NetC120_2: C120.2 R65.1 U7.9(RCB)
NetJ3_1: J3.1 U7.4(AOUT1)
NetJ3_2: J3.2 U7.25(AOUT2)
NetJ3_3: J3.3 U7.11(BOUT1)
NetJ3_4: J3.4 U7.18(BOUT2)
NetR62_2: R62.2 U7.1(ISENA)
NetR63_2: R63.2 U7.14(ISENB)

### Notes on the sheet
- MOTOR_HOME
  LOW when at home position
  HIGH when any other position
- DECAY MODES
  Fast Decay : < 0.21xVcc
  MOTOR_DECAY = 0
  Slow Decay : > 0.6xVcc
  MOTOR_DECAY = 1
- Rsense = (Vref /Ifs) / Av
- With Vref = 3.3V, Rsense = 220m
- Sheet Name
- Project Title
- Global Project
- Size
- Group
- Revision
- Date
- Sheet
- of
- Filename
- Designers
- (in symbol CONN_TERMINAL_OSTTC040162) 5MM; TERMINAL BLOCK
- (in symbol POW_MOTOR_DRV8811PWPR, part A) Motor Driver Control Logic
- (in symbol POW_MOTOR_DRV8811PWPR, part B) Motor Driver A
- (in symbol POW_MOTOR_DRV8811PWPR, part C) Motor Driver B

### Library data of the parts
C107-C109 = CAP - 0402: Precision: 10%; Current: *; CreatedBy: Jonathan Bouchard; Power: *
C110 C111 C113-C120 = CAP - 1206: Precision: 10%; Current: *; CreatedBy: Jonathan Bouchard; Power: *
  C120: Parameter 1: *
C112 = CAP_ALU_MAL215099101E3: as C11 on sheet S7CAS-PLEIADES-CARTE-MERE_P02_DDR3; Mfg Part Number: MAL215099101E3; HelpURL: http://www.vishay.com/docs/28395/150crz.pdf; CreatedBy: Jonathan Bouchard; Temperature: -55°C to 125°C; Power: *; Supplier 1: Digikey; Supplier Part Number 1: 4399PHDKR-ND
J3 = CONN_TERMINAL_OSTTC040162: CONN -  TERMINAL BLOCK 4POS 5MM - TH; Mfg: On Shore Technology Inc.; Voltage: *; Current: *; Power: *; Mfg Part Number: OSTTC040162; HelpURL: http://www.on-shore.com/wp-content/uploads/2015/09/osttcxx0162.pdf; CreatedBy: Jonathan Bouchard; Temperature: -30°C ~ 105°C; Value: *; Precision: *; Package: TH-4; Supplier 1: Digikey; Supplier Part Number 1: ED2602-ND
R60-R65 = RES - 0402: Voltage: 50V; Power: 1/16W; Current: *; CreatedBy: Jonathan Bouchard
  R60 R61 R64 R65: Parameter 1: *
U7 = POW_MOTOR_DRV8811PWPR: POW - STEPPER MOTOR DRIVER - SOP-28; Voltage: 3 V ~ 5.5 V / 8 V ~ 38 V; Mfg: Texas Instrument; Current: *; Power: *; Mfg Part Number: DRV8811PWPR; HelpURL: http://www.ti.com/lit/ds/symlink/drv8811.pdf; CreatedBy: Jonathan Bouchard; Temperature: -40°C ~ 150°C (TJ); Value: *; Precision: *; Package: SOP-28; Supplier 1: Digikey; Supplier Part Number 1: 296-24591-1-ND
L7 = FER - 0603: Voltage: *; CreatedBy: Jonathan Bouchard; Power: *; Precision: *

## Sheet S7CAS-PLEIADES-CARTE-MERE_P02_ETHERNET.SchDoc
size Tabloid; DocumentNumber: 10; SheetNumber: 10; SheetTotal: 14; Size: 11x17; Sheet_Name: Ethernet
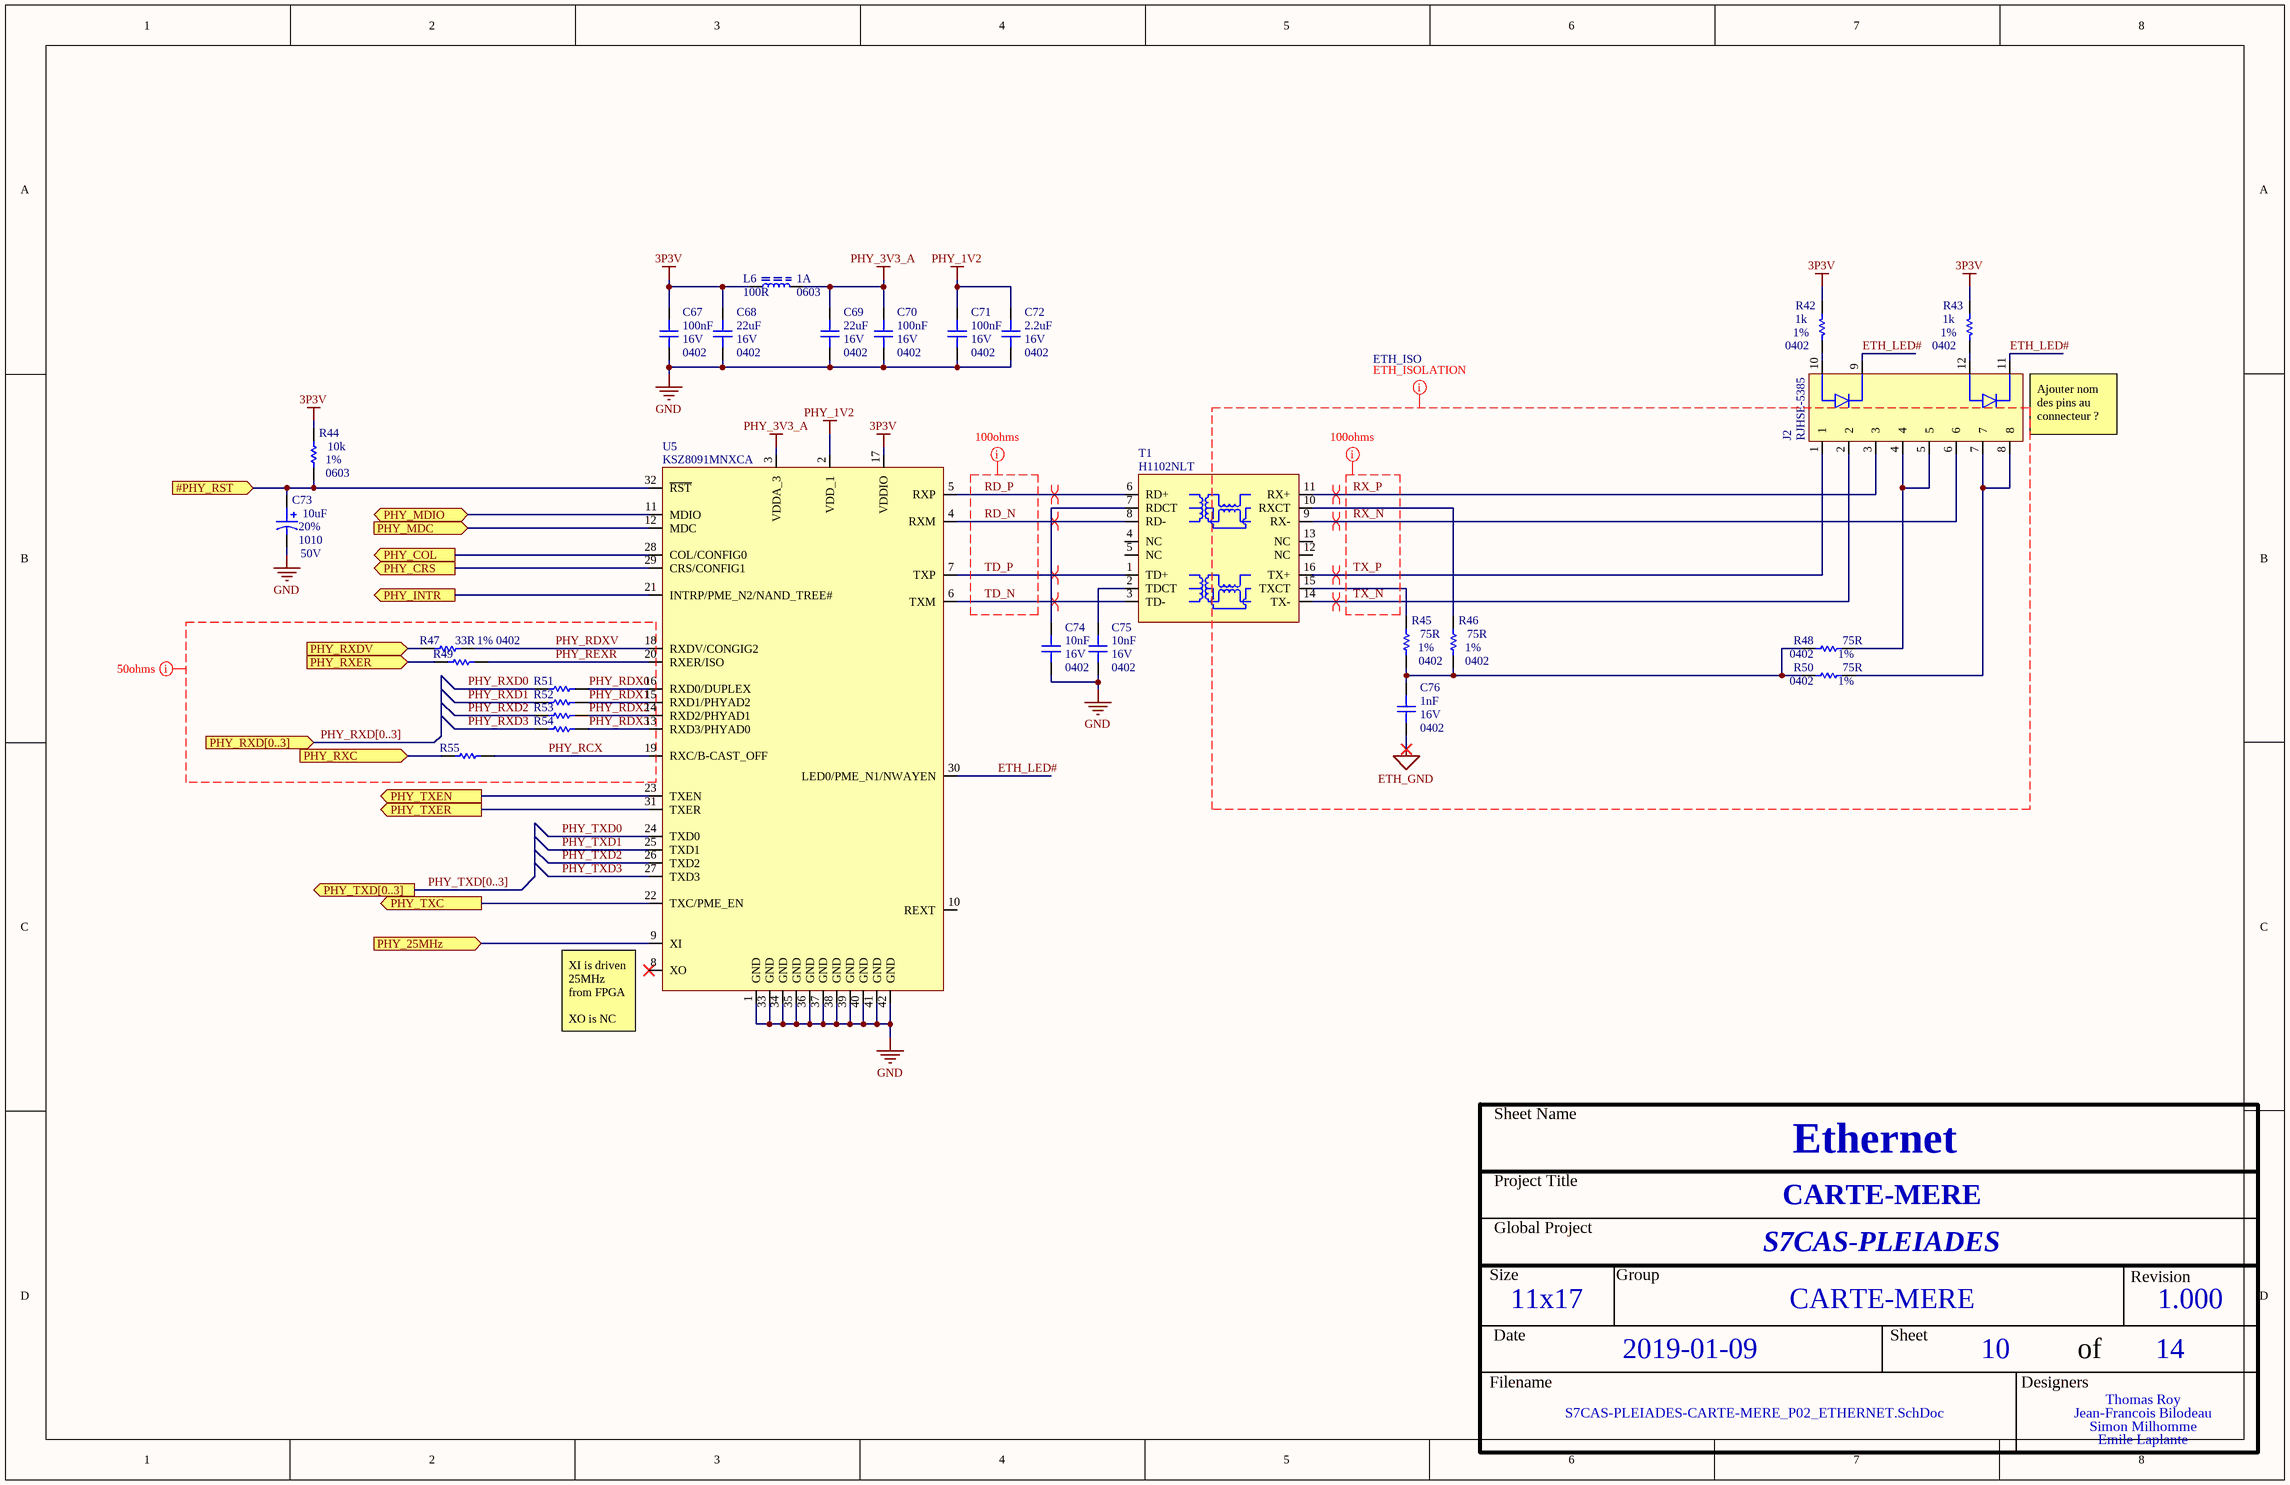
[diagram p8: S7CAS-PLEIADES-CARTE-MERE_P02_ETHERNET.SchDoc]

### Parts
C67  value 100nF  Voltage: 16V  Package: 0402  [CAP_0402]  (hidden comment: CAP - 0402)
C68  value 22uF  Voltage: 16V  Package: 0402  [CAP_0402]  (hidden comment: CAP - 0402)
C69  value 22uF  Voltage: 16V  Package: 0402  [CAP_0402]  (hidden comment: CAP - 0402)
C70  value 100nF  Voltage: 16V  Package: 0402  [CAP_0402]  (hidden comment: CAP - 0402)
C71  value 100nF  Voltage: 16V  Package: 0402  [CAP_0402]  (hidden comment: CAP - 0402)
C72  value 2.2uF  Voltage: 16V  Package: 0402  [CAP_0402]  (hidden comment: CAP - 0402)
C73  value 10uF  Voltage: 50V  Package: 1010  Precision: 20%  [CAP_ALU_1010_vishay]  (hidden comment: MAL215099101E3)
C74  value 10nF  Voltage: 16V  Package: 0402  [CAP_0402]  (hidden comment: CAP - 0402)
C75  value 10nF  Voltage: 16V  Package: 0402  [CAP_0402]  (hidden comment: CAP - 0402)
C76  value 1nF  Voltage: 16V  Package: 0402  [CAP_0402]  (hidden comment: CAP - 0402)
J2  RJHSE-5385  [CONN_ETHERNET_RJHSE-5385]
L6  value 100R  Current: 1A  Package: 0603  [FER_0603]  (hidden comment: FER - 0603)
R42  value 1k  Package: 0402  Precision: 1%  [RES_0402]  (hidden comment: RES - 0402)
R43  value 1k  Package: 0402  Precision: 1%  [RES_0402]  (hidden comment: RES - 0402)
R44  value 10k  Package: 0603  Precision: 1%  [RES_0603]  (hidden comment: RES - 0603)
R45  value 75R  Package: 0402  Precision: 1%  [RES_0402]  (hidden comment: RES - 0402)
R46  value 75R  Package: 0402  Precision: 1%  [RES_0402]  (hidden comment: RES - 0402)
R47  value 33R  Package: 0402  Precision: 1%  [RES_0402]  (hidden comment: RES - 0402)
R48  value 75R  Package: 0402  Precision: 1%  [RES_0402]  (hidden comment: RES - 0402)
R49  RES - 0402  [RES_0402]  (value not drawn)
R50  value 75R  Package: 0402  Precision: 1%  [RES_0402]  (hidden comment: RES - 0402)
R51  RES - 0402  [RES_0402]  (value not drawn)
R52  RES - 0402  [RES_0402]  (value not drawn)
R53  RES - 0402  [RES_0402]  (value not drawn)
R54  RES - 0402  [RES_0402]  (value not drawn)
R55  RES - 0402  [RES_0402]  (value not drawn)
T1  H1102NLT  [TRANSFO_H1102NLT]
U5  KSZ8091MNXCA  [COM_ETH_PHY_KSZ8091MNXCA]

### Ports
#PHY_RST (in), PHY_25MHz (in), PHY_COL (out), PHY_CRS (out), PHY_INTR (out), PHY_MDC (in), PHY_MDIO (bidir), PHY_RXC (in), PHY_RXD[0..3] (in), PHY_RXDV (in), PHY_RXER (in), PHY_TXC (out), PHY_TXD[0..3] (out), PHY_TXEN (out), PHY_TXER (out)

### Nets
3P3V: C67.2 C68.2 L6.2 R42.2 R43.2 R44.2 U5.17(VDDIO)
ETH_GND: C76.1
GND: C67.1 C68.1 C69.1 C70.1 C71.1 C72.1 C73.2 C74.1 C75.1 U5.1(GND) U5.33(GND) U5.34(GND) U5.35(GND) U5.36(GND) U5.37(GND) U5.38(GND) U5.39(GND) U5.40(GND) U5.41(GND) U5.42(GND)
PHY_1V2: C71.2 C72.2 U5.2(VDD_1)
PHY_3V3_A: C69.2 C70.2 L6.1 U5.3(VDDA_3)
#PHY_RST: C73.1 R44.1 U5.32(~{RST}) ; port #PHY_RST
ETH_LED#: J2.9(LED1_K) J2.11(LED2_K) U5.30(LED0/PME_N1/NWAYEN)
PHY_25MHz: U5.9(XI) ; port PHY_25MHz
PHY_COL: U5.28(COL/CONFIG0) ; port PHY_COL
PHY_CRS: U5.29(CRS/CONFIG1) ; port PHY_CRS
PHY_INTR: U5.21(INTRP/PME_N2/NAND_TREE#) ; port PHY_INTR
PHY_MDC: U5.12(MDC) ; port PHY_MDC
PHY_MDIO: U5.11(MDIO) ; port PHY_MDIO
PHY_RCX: R55.1 U5.19(RXC/B-CAST_OFF)
PHY_RDX0: R51.1 U5.16(RXD0/DUPLEX)
PHY_RDX1: R52.1 U5.15(RXD1/PHYAD2)
PHY_RDX2: R53.1 U5.14(RXD2/PHYAD1)
PHY_RDX3: R54.1 U5.13(RXD3/PHYAD0)
PHY_RDXV: R47.1 U5.18(RXDV/CONGIG2)
PHY_REXR: R49.1 U5.20(RXER/ISO)
PHY_RXC: R55.2 ; port PHY_RXC
PHY_RXD0: R51.2
PHY_RXD1: R52.2
PHY_RXD2: R53.2
PHY_RXD3: R54.2
PHY_RXDV: R47.2 ; port PHY_RXDV
PHY_RXER: R49.2 ; port PHY_RXER
PHY_TXC: U5.22(TXC/PME_EN) ; port PHY_TXC
PHY_TXD0: U5.24(TXD0)
PHY_TXD1: U5.25(TXD1)
PHY_TXD2: U5.26(TXD2)
PHY_TXD3: U5.27(TXD3)
PHY_TXEN: U5.23(TXEN) ; port PHY_TXEN
PHY_TXER: U5.31(TXER) ; port PHY_TXER
RD_N: T1.8(RD-) U5.4(RXM)
RD_P: T1.6(RD+) U5.5(RXP)
RX_N: J2.6 T1.9(RX-)
RX_P: J2.3 T1.11(RX+)
TD_N: T1.3(TD-) U5.6(TXM)
TD_P: T1.1(TD+) U5.7(TXP)
TX_N: J2.2 T1.14(TX-)
TX_P: J2.1 T1.16(TX+)
NetC74_2: C74.2 T1.7(RDCT)
NetC75_2: C75.2 T1.2(TDCT)
NetC76_2: C76.2 R45.1 R46.1 R48.1 R50.1
NetJ2_4: J2.4 J2.5 R48.2
NetJ2_7: J2.7 J2.8 R50.2
NetJ2_10: J2.10(LED1_A) R42.1
NetJ2_12: J2.12(LED2_A) R43.1
NetR45_2: R45.2 T1.15(TXCT)
NetR46_2: R46.2 T1.10(RXCT)

Not connected (* = marked no-connect by the designer): T1 4(NC) 5(NC) 12(NC) 13(NC); U5 8(XO)* 10(REXT)

### Buses and harness runs
bus PHY_RXD[0..3] = port PHY_RXD[0..3]
bus PHY_TXD[0..3] = port PHY_TXD[0..3]

### Layout directives
net class 50ohms: PHY_RCX, PHY_RDX0, PHY_RDX1, PHY_RDX2, PHY_RDX3, PHY_RDXV, PHY_REXR, PHY_RXD0, PHY_RXD1, PHY_RXD2, PHY_RXD3, PHY_RXD[0..3]
net class 100ohms: RD_N, RD_P, RX_N, RX_P, TD_N, TD_P, TX_N, TX_P
differential pair: RD_N, RX_N, RX_P, TD_N, TD_P, TX_N, TX_P
differential pair; differential pair class *; differential pair class *: RD_P
net class ETH_ISO: ETH_GND, RX_N, RX_P, TX_N, TX_P

### Notes on the sheet
- (near J2) Ajouter nom des pins au connecteur ?
- (near U5) XI is driven 25MHz from FPGA
  XO is NC
- Sheet Name
- Project Title
- Global Project
- Size
- Group
- Revision
- Date
- Sheet
- of
- Filename
- Designers

### Library data of the parts
C67-C72 C74-C76 = CAP - 0402: Precision: 10%; Current: *; CreatedBy: Jonathan Bouchard; Power: *
C73 = CAP_ALU_MAL215099101E3: as C11 on sheet S7CAS-PLEIADES-CARTE-MERE_P02_DDR3; Mfg Part Number: MAL215099101E3; HelpURL: http://www.vishay.com/docs/28395/150crz.pdf; CreatedBy: Jonathan Bouchard; Temperature: -55°C to 125°C; Power: *; Supplier 1: Digikey; Supplier Part Number 1: 4399PHDKR-ND
J2 = CONN_ETHERNET_RJHSE-5385: CONN - MOD JACK RJ45 R/A ETHERNET - TH; Mfg: Amphenol; Voltage: *; Current: *; Power: *; Mfg Part Number: RJHSE-5385; HelpURL: https://www.amphenolcanada.com/ProductSearch/drawings/AC/RJHSE538X.pdf; CreatedBy: Jonathan Bouchard; Temperature: -55°C ~ 85°C; Value: *; Precision: *; Package: TH-12; Supplier 1: Digikey; Supplier Part Number 1: RJHSE-5385-ND
R42 R43 R45-R55 = RES - 0402: Voltage: 50V; Power: 1/16W; Current: *; CreatedBy: Jonathan Bouchard
T1 = TRANSFO_H1102NLT: TRANSFO - ETHERNET 10/100B-TX - SMD-16; Mfg: Pulse Eng.; Value: 1:1 (350uH); Voltage: *; Current: *; Power: *; Mfg Part Number: H1102NLT; HelpURL: http://media.digikey.com/pdf/Data%20Sheets/Pulse%20PDFs/10_100BASE-T%20Single%20Port%20SMD%20Magnetics_Rev2008.pdf; CreatedBy: Jonathan Bouchard; Temperature: -40°C to 85°C; Precision: *; Package: SMD-16; Supplier 1: Digikey; Supplier Part Number 1: 553-1532-1-ND
U5 = COM_ETH_PHY_KSZ8091MNXCA: COM - ETHERNET PHY 10/100 - QFN-32; Voltage: 1.8V, 2.5V, 3.3V; Mfg: Micrel; Current: *; Power: *; Mfg Part Number: KSZ8091MNXCA; HelpURL: http://ww1.microchip.com/downloads/en/DeviceDoc/00002275A.pdf; CreatedBy: Jonathan Bouchard; Temperature: 0°C ~ 70°C; Value: *; Precision: *; Package: QFN-32; Supplier 1: Digikey; Supplier Part Number 1: 576-4356-ND
L6 = FER - 0603: Voltage: *; CreatedBy: Jonathan Bouchard; Power: *; Precision: *
R44 = RES - 0603: Current: *; CreatedBy: Jonathan Bouchard

## Sheet S7CAS-PLEIADES-CARTE-MERE_P02_USB.SchDoc
size Tabloid; DocumentNumber: 11; SheetNumber: 11; SheetTotal: 14; Size: 11x17; Sheet_Name: USB
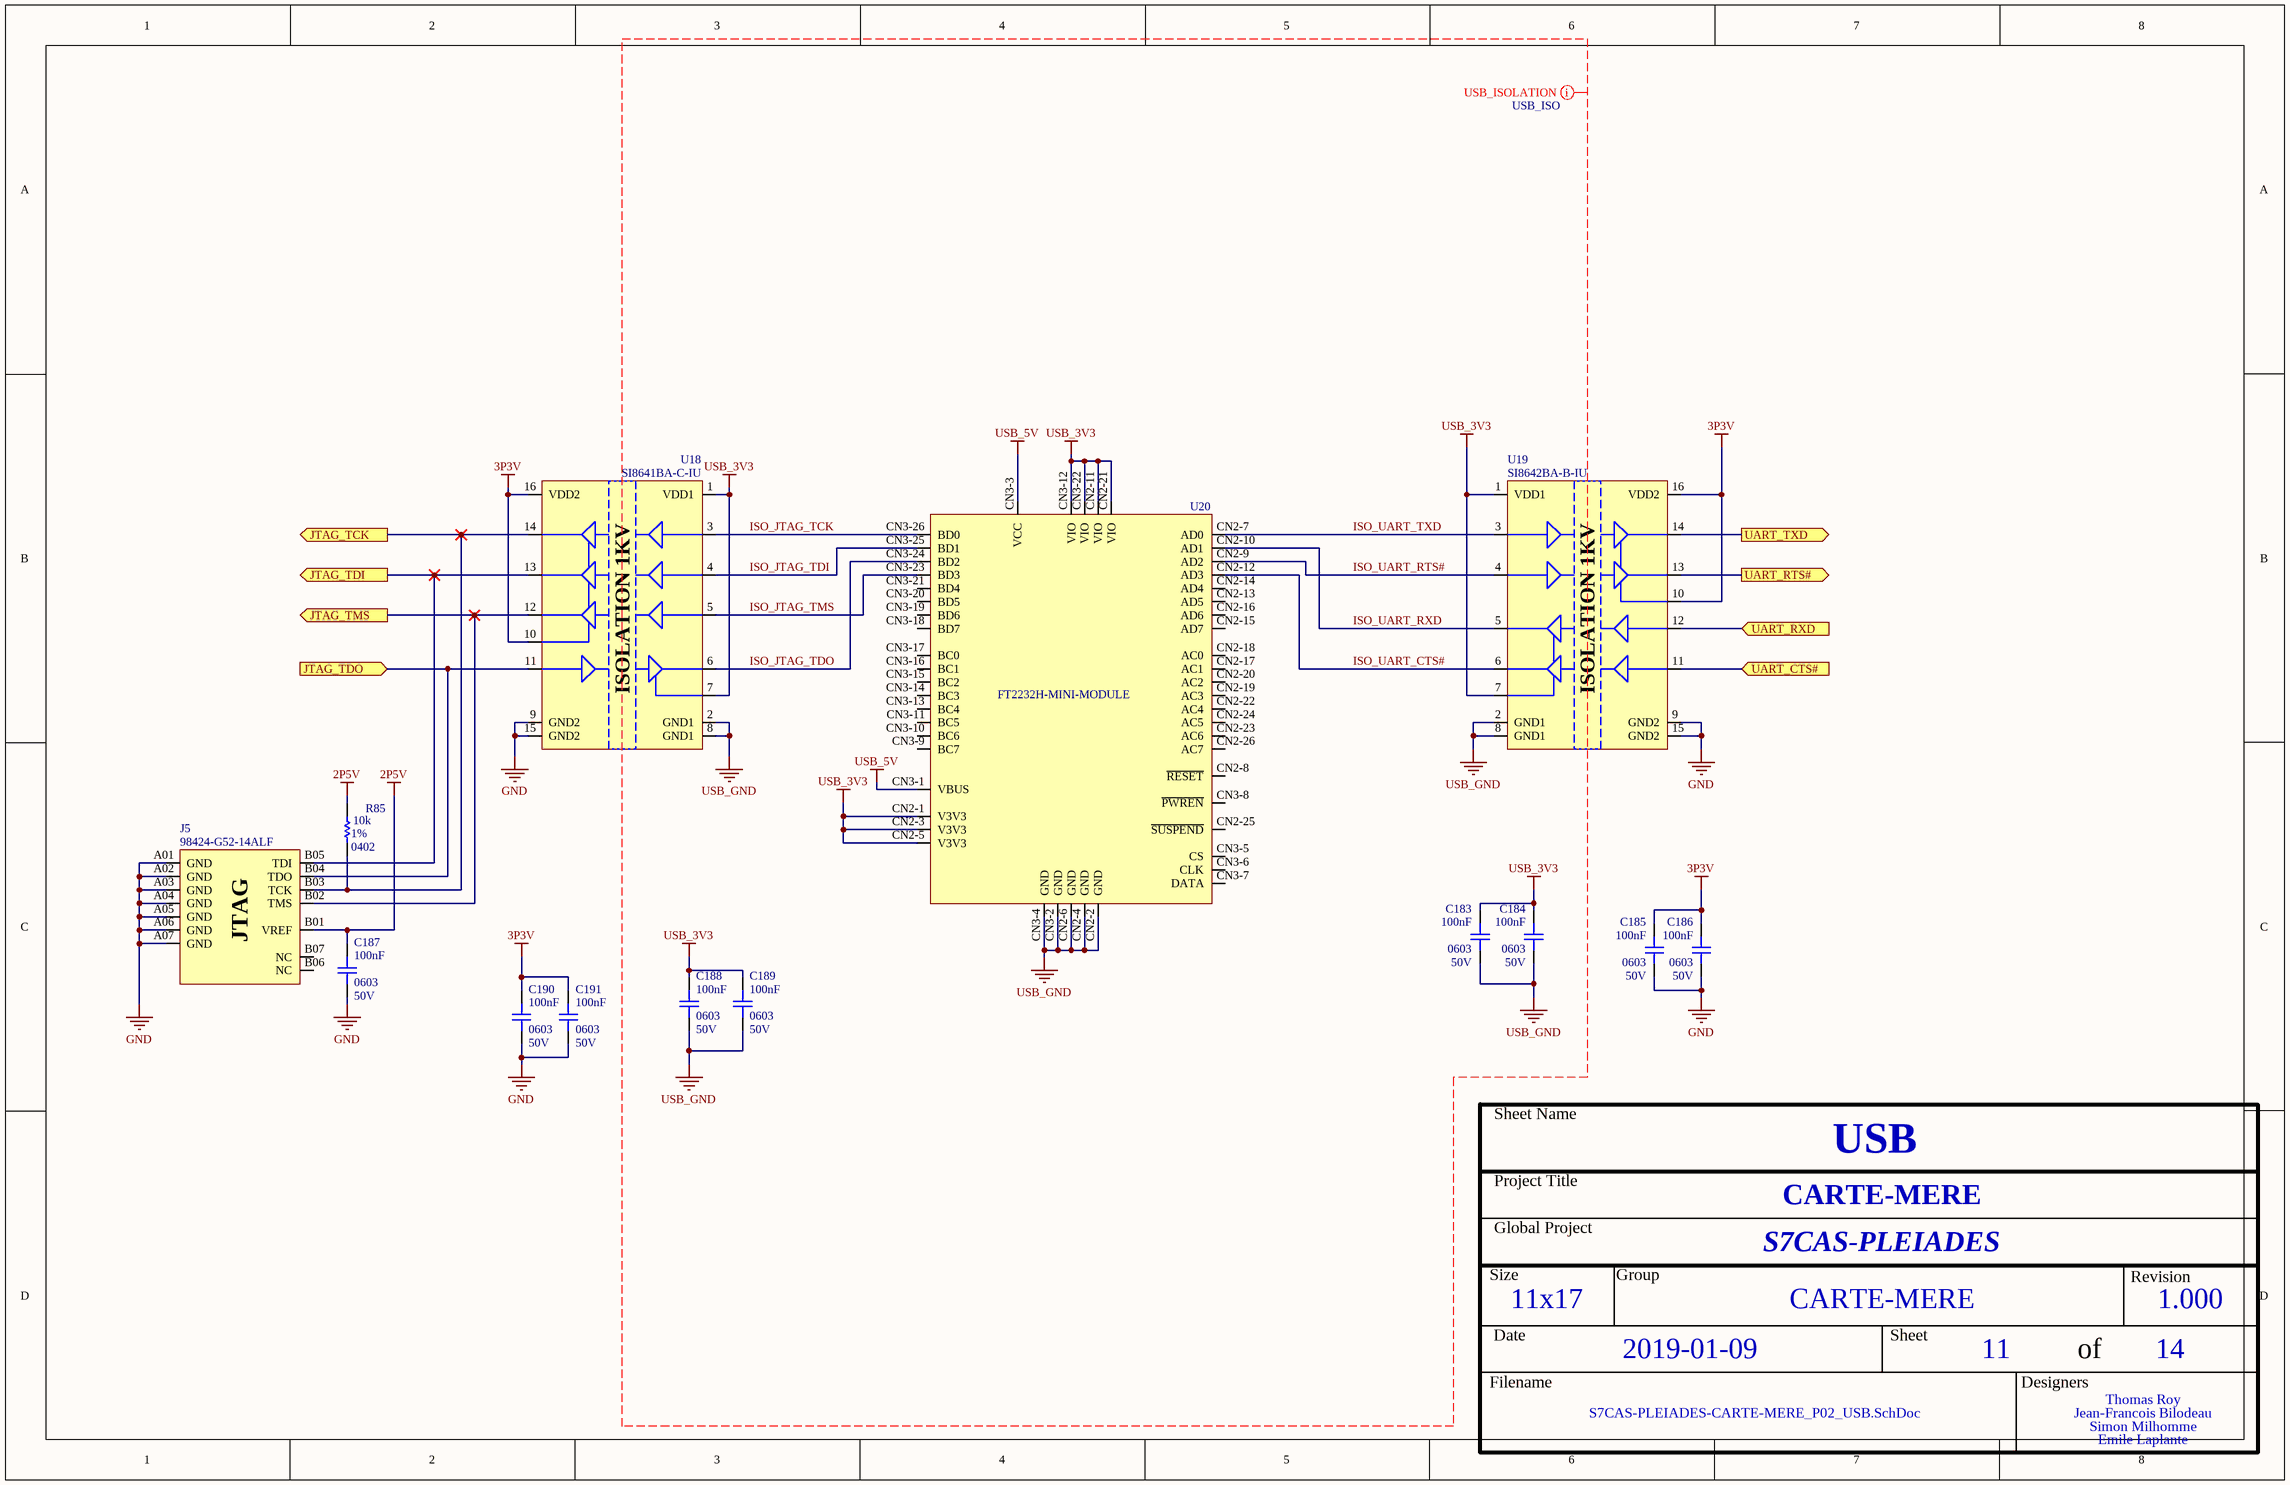
[diagram p9: S7CAS-PLEIADES-CARTE-MERE_P02_USB.SchDoc]

### Parts
C183  value 100nF  Voltage: 50V  Package: 0603  [CAP_0603]  (hidden comment: CAP - 0603)
C184  value 100nF  Voltage: 50V  Package: 0603  [CAP_0603]  (hidden comment: CAP - 0603)
C185  value 100nF  Voltage: 50V  Package: 0603  [CAP_0603]  (hidden comment: CAP - 0603)
C186  value 100nF  Voltage: 50V  Package: 0603  [CAP_0603]  (hidden comment: CAP - 0603)
C187  value 100nF  Voltage: 50V  Package: 0603  [CAP_0603]  (hidden comment: CAP - 0603)
C188  value 100nF  Voltage: 50V  Package: 0603  [CAP_0603]  (hidden comment: CAP - 0603)
C189  value 100nF  Voltage: 50V  Package: 0603  [CAP_0603]  (hidden comment: CAP - 0603)
C190  value 100nF  Voltage: 50V  Package: 0603  [CAP_0603]  (hidden comment: CAP - 0603)
C191  value 100nF  Voltage: 50V  Package: 0603  [CAP_0603]  (hidden comment: CAP - 0603)
J5  98424-G52-14ALF  [CON_JTAG_98424-G52-14ALF]
R85  value 10k  Package: 0402  Precision: 1%  [RES_0402]  (hidden comment: RES - 0402)
U18  SI8641BA-C-IU  [ISO_SI8642BA-B-IU]
U19  SI8642BA-B-IU  [ISO_SI8642BA-B-IU]
U20  FT2232H-MINI-MODULE  [COM_USB_FT2232H-MINI-MODULE]

### Ports
JTAG_TCK (out), JTAG_TDI (out), JTAG_TDO (in), JTAG_TMS (out), UART_CTS# (in), UART_RTS# (out), UART_RXD (in), UART_TXD (out)

### Nets
2P5V: C187.2 J5.B01(VREF) R85.2
3P3V: C185.2 C186.2 C190.2 C191.2 U18.10(EN2) U18.16(VDD2) U19.10(EN2) U19.16(VDD2)
GND: C185.1 C186.1 C187.1 C190.1 C191.1 J5.A01(GND) J5.A02(GND) J5.A03(GND) J5.A04(GND) J5.A05(GND) J5.A06(GND) J5.A07(GND) U18.9(GND2) U18.15(GND2) U19.9(GND2) U19.15(GND2)
USB_3V3: C183.2 C184.2 C188.2 C189.2 U18.1(VDD1) U18.7(EN1) U19.1(VDD1) U19.7(EN1) U20.CN2-1(V3V3) U20.CN2-3(V3V3) U20.CN2-5(V3V3) U20.CN2-11(VIO) U20.CN2-21(VIO) U20.CN3-12(VIO) U20.CN3-22(VIO)
USB_5V: U20.CN3-1(VBUS) U20.CN3-3(VCC)
USB_GND: C183.1 C184.1 C188.1 C189.1 U18.2(GND1) U18.8(GND1) U19.2(GND1) U19.8(GND1) U20.CN2-2(GND) U20.CN2-4(GND) U20.CN2-6(GND) U20.CN3-2(GND) U20.CN3-4(GND)
ISO_JTAG_TCK: U18.3(A1) U20.CN3-26(BD0)
ISO_JTAG_TDI: U18.4(A2) U20.CN3-25(BD1)
ISO_JTAG_TDO: U18.6(A4) U20.CN3-24(BD2)
ISO_JTAG_TMS: U18.5(A3) U20.CN3-23(BD3)
ISO_UART_CTS#: U19.6(A4) U20.CN2-12(AD3)
ISO_UART_RTS#: U19.4(A2) U20.CN2-9(AD2)
ISO_UART_RXD: U19.5(A3) U20.CN2-10(AD1)
ISO_UART_TXD: U19.3(A1) U20.CN2-7(AD0)
JTAG_TCK: J5.B03(TCK) R85.1 U18.14(B1) ; port JTAG_TCK
JTAG_TDI: J5.B05(TDI) U18.13(B2) ; port JTAG_TDI
JTAG_TDO: J5.B04(TDO) U18.11(B4) ; port JTAG_TDO
JTAG_TMS: J5.B02(TMS) U18.12(B3) ; port JTAG_TMS
UART_CTS#: U19.11(B4) ; port UART_CTS#
UART_RTS#: U19.13(B2) ; port UART_RTS#
UART_RXD: U19.12(B3) ; port UART_RXD
UART_TXD: U19.14(B1) ; port UART_TXD

Not connected (* = marked no-connect by the designer): J5 B06(NC) B07(NC); U20 CN2-8(~{RESET}) CN2-13(AD5) CN2-14(AD4) CN2-15(AD7) CN2-16(AD6) CN2-17(AC1) CN2-18(AC0) CN2-19(AC3) CN2-20(AC2) CN2-22(AC4) CN2-23(AC6) CN2-24(AC5) CN2-25(~{SUSPEND}) CN2-26(AC7) CN3-5(CS) CN3-6(CLK) CN3-7(DATA) CN3-8(~{PWREN}) CN3-9(BC7) CN3-10(BC6) CN3-11(BC5) CN3-13(BC4) CN3-14(BC3) CN3-15(BC2) CN3-16(BC1) CN3-17(BC0) CN3-18(BD7) CN3-19(BD6) CN3-20(BD5) CN3-21(BD4)

### Layout directives
net class USB_ISO: ISO_JTAG_TCK, ISO_JTAG_TDI, ISO_JTAG_TDO, ISO_JTAG_TMS, ISO_UART_CTS#, ISO_UART_RTS#, ISO_UART_RXD, ISO_UART_TXD, USB_3V3, USB_5V, USB_GND

### Notes on the sheet
- (near U20) CS, CLK & DATA sont des signaux connectés sur le mini module à l'EEPROM
- Sheet Name
- Project Title
- Global Project
- Size
- Group
- Revision
- Date
- Sheet
- of
- Filename
- Designers
- (in symbol CONN_JTAG_98424-G52-14ALF) JTAG
- (in symbol ISO_SI8641BA-C-IU) ISOLATION 1KV
- (in symbol ISO_SI8642BA-B-IU) ISOLATION 1KV

### Library data of the parts
C183-C191 = CAP - 0603: Precision: 10%; Current: *; CreatedBy: Jonathan Bouchard; Power: *
J5 = CONN_JTAG_98424-G52-14ALF: CONN -  JTAG HEADER XILINX - 14-SMD; Mfg: Amphenol; Voltage: *; Current: *; Power: *; Mfg Part Number: 98424-G52-14ALF; HelpURL: http://portal.fciconnect.com/Comergent//fci/drawing/98424.pdf; CreatedBy: Jonathan Bouchard; Temperature: *; Value: *; Precision: *; Package: 14-SMD; Supplier 1: Digikey; Supplier Part Number 1: 609-2643-1-ND
R85 = RES - 0402: Voltage: 50V; Power: 1/16W; Current: *; CreatedBy: Jonathan Bouchard
U18 = ISO_SI8641BA-C-IU: ISO - DIGITAL ISOLATOR 1KV 4CH 3:1 GEN PURP -  SOP-16; Voltage: 2.5 V ~ 5.5 V; Mfg: Silicon Labs; Current: *; Power: *; Mfg Part Number: SI8641BA-C-IU; HelpURL: http://www.silabs.com/Support%20Documents/TechnicalDocs/si864x-datasheet.pdf; CreatedBy: Jonathan Bouchard; Temperature: -40°C ~ 125°C; Value: *; Precision: *; Package: SOP-16; Supplier 1: Digikey; Supplier Part Number 1: SI8641BA-C-IU-ND
U19 = ISO_SI8642BA-B-IU: ISO - DIGITAL ISOLATOR 1KV 4CH 2:2 GEN PURP -  SOP-16; Voltage: 2.5 V ~ 5.5 V; Mfg: Silicon Labs; Current: *; Power: *; Mfg Part Number: SI8642BA-B-IU; HelpURL: http://www.silabs.com/Support%20Documents/TechnicalDocs/si864x-datasheet.pdf; CreatedBy: Jonathan Bouchard; Temperature: -40°C ~ 125°C; Value: *; Precision: *; Package: SOP-16; Supplier 1: Digikey; Supplier Part Number 1: 336-2091-5-ND
U20 = COM_USB_FT2232H-MINI-MODULE: COM - USB FTDI FT2232H Mini-Module - TH; Mfg: Micrel; Voltage: *; Current: *; Power: *; Mfg Part Number: FT2232H-MINI-MODULE; HelpURL: http://www.ftdichip.com/Support/Documents/DataSheets/Modules/DS_FT2232H_Mini_Module.pdf; CreatedBy: Jonathan Bouchard; Temperature: *; Value: *; Precision: *; Package: TH; Supplier 1: Digikey; Supplier Part Number 1: 768-1030-ND